# Altium schematic sheet complete.SchDoc (part 1 of 2)
size A0; PageSetup: Record=PageOptions|CenterHorizontal=True|CenterVertical=True|PrintScale=1.00|XCorrection=1.00|YCorrection=1.00|PrintKind=0|BorderSize=5000000|LeftOffset=0|BottomOffset=0|Orientation=2|PaperLength=1000|PaperWidth=1000|Scale=100|PaperSource=7|PrintQuality=-3|MediaType=1|DitherType=10|PrintScaleMode=1|PaperKind=A4|PaperIndex=9
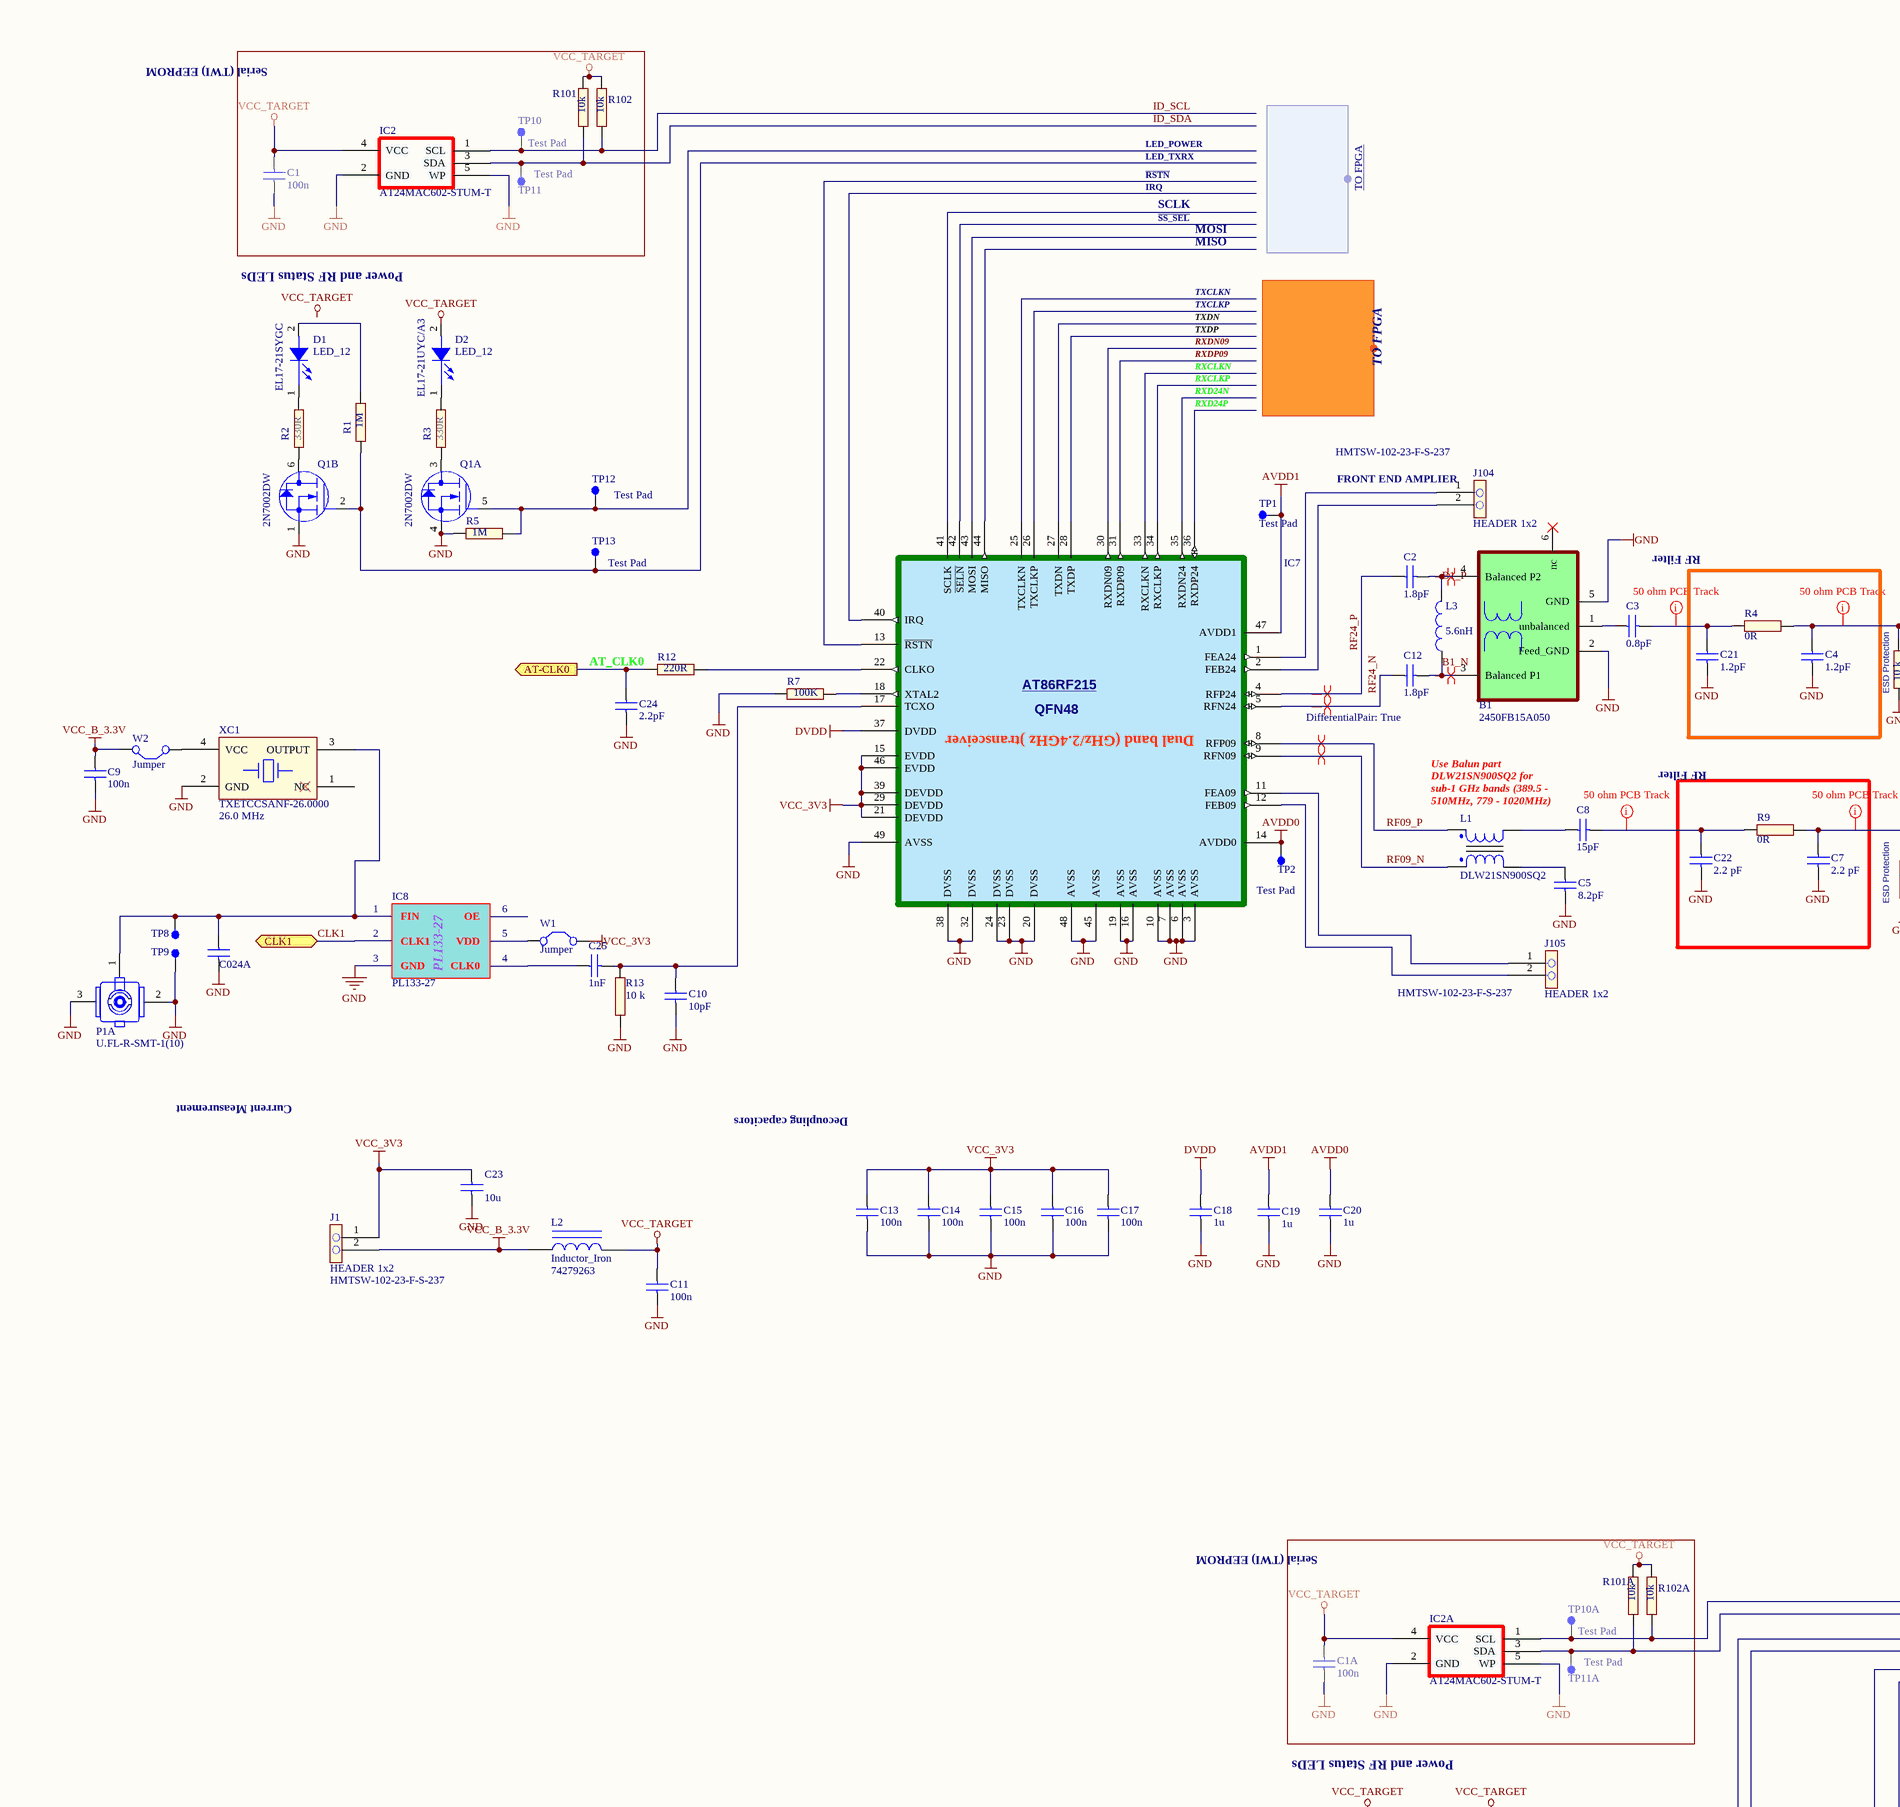
[diagram p0: complete.SchDoc, top left]
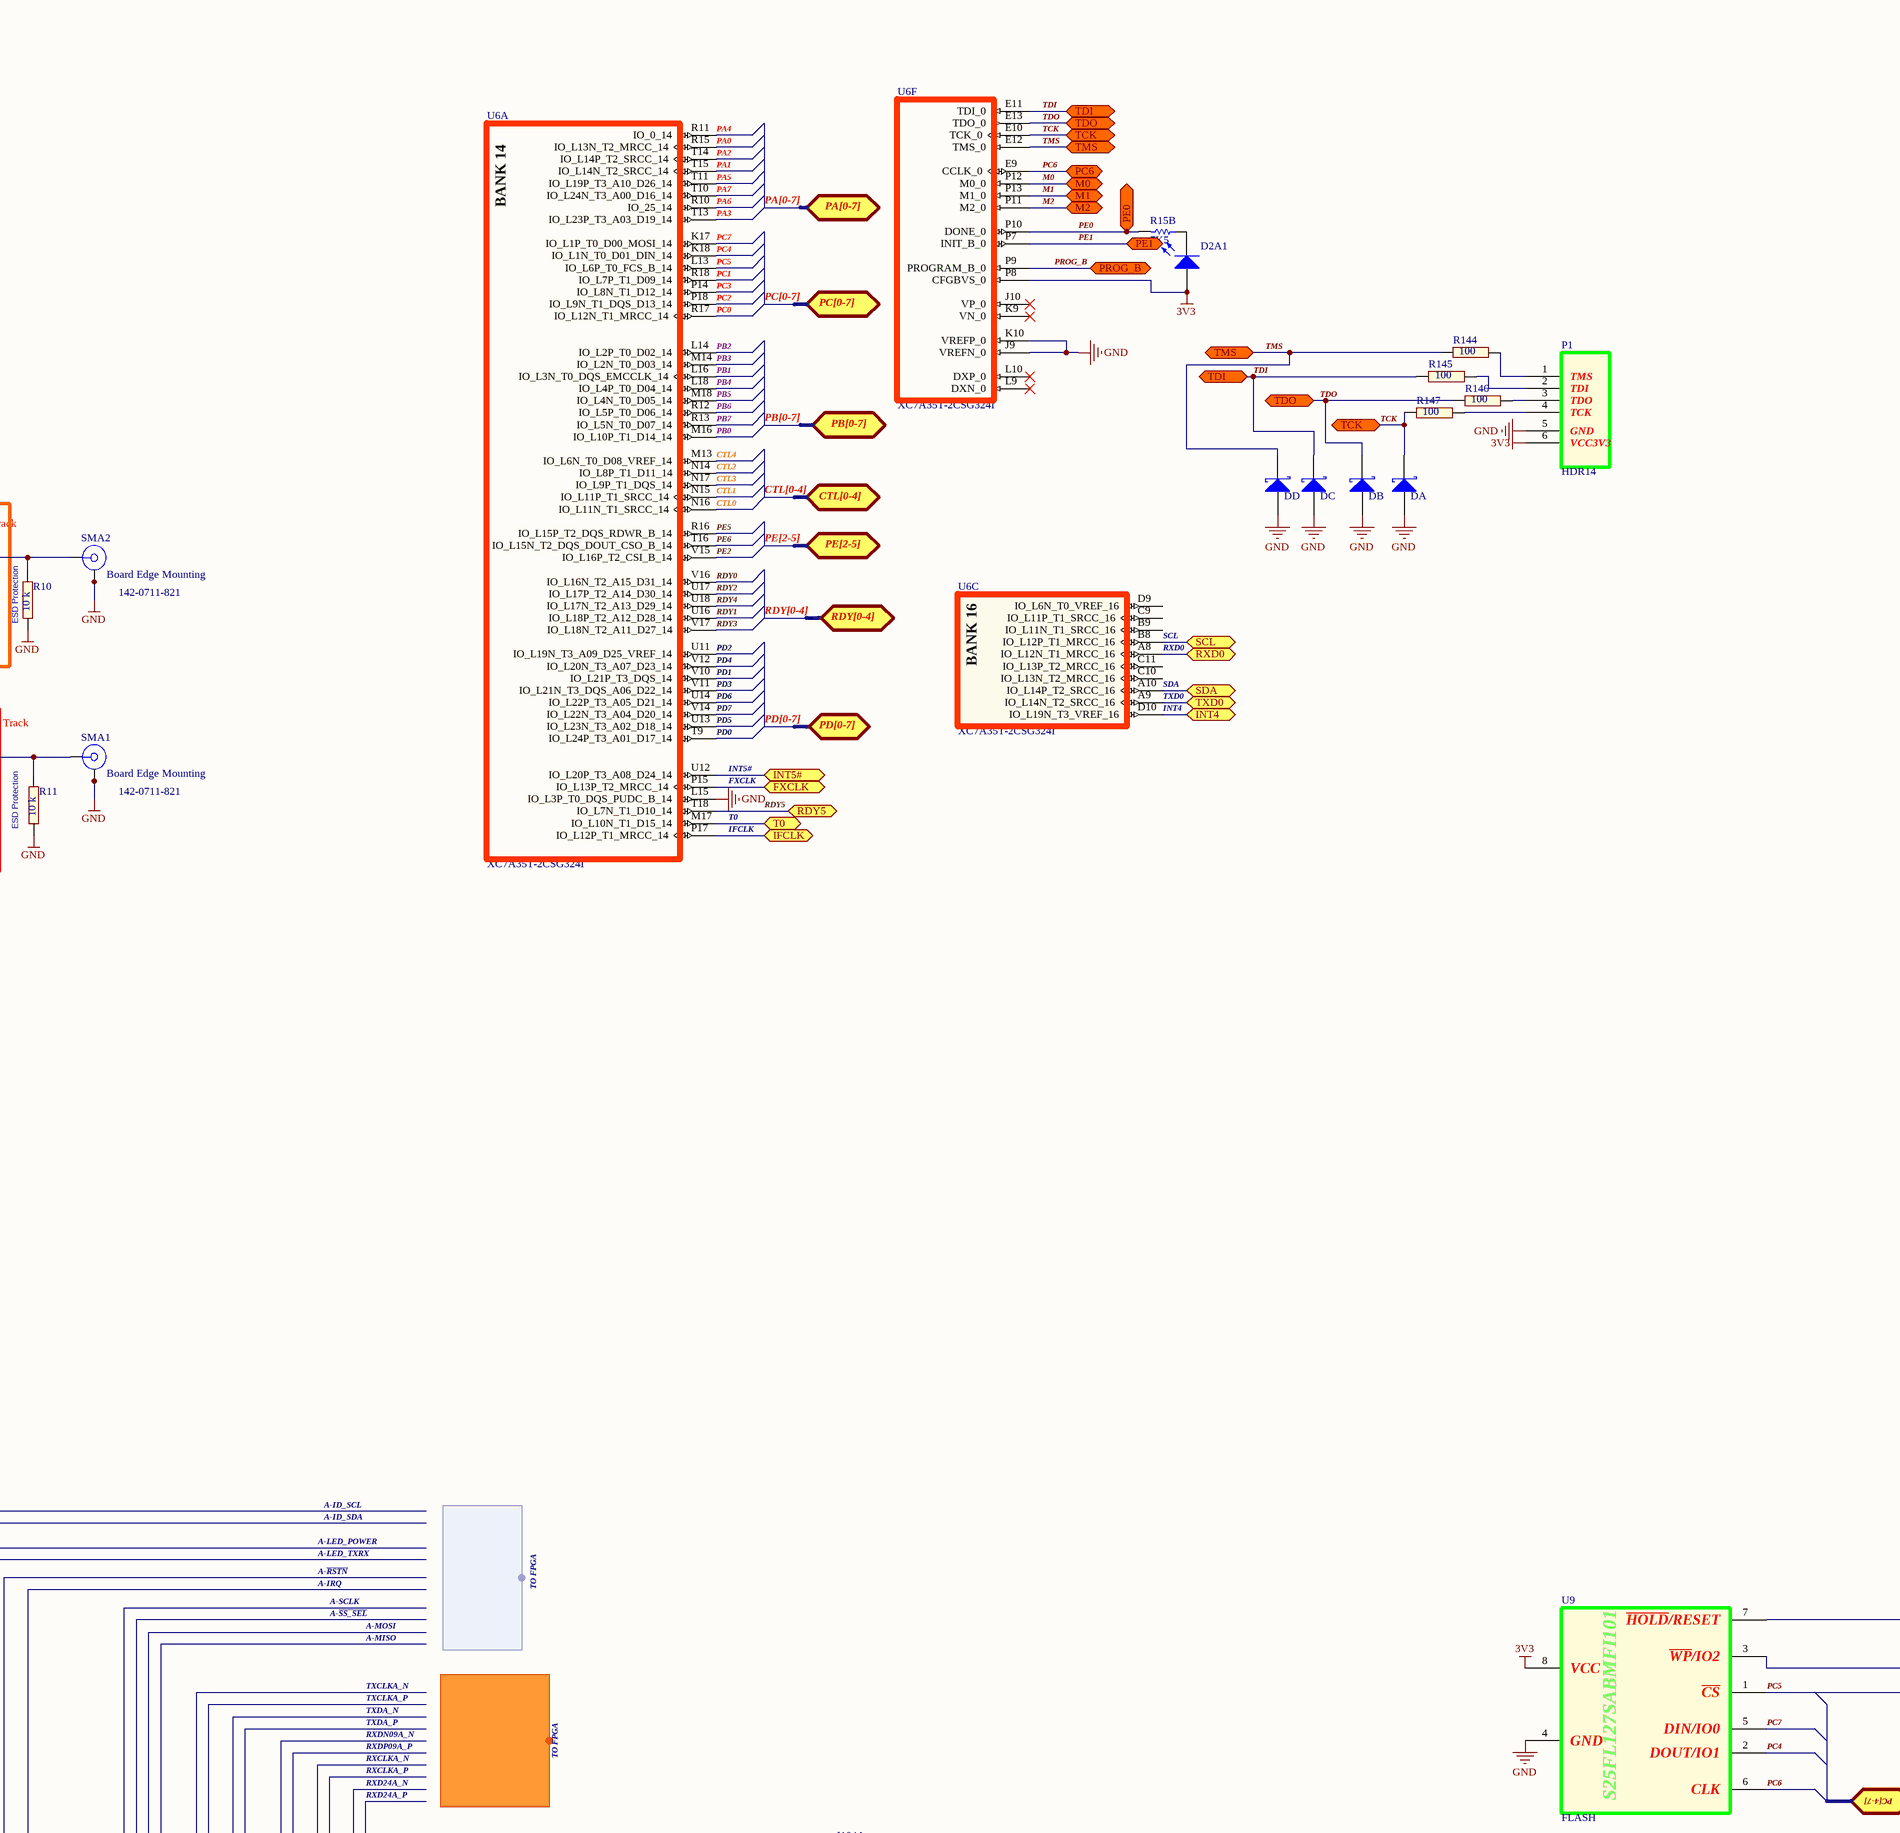
[diagram p1: complete.SchDoc, top middle]
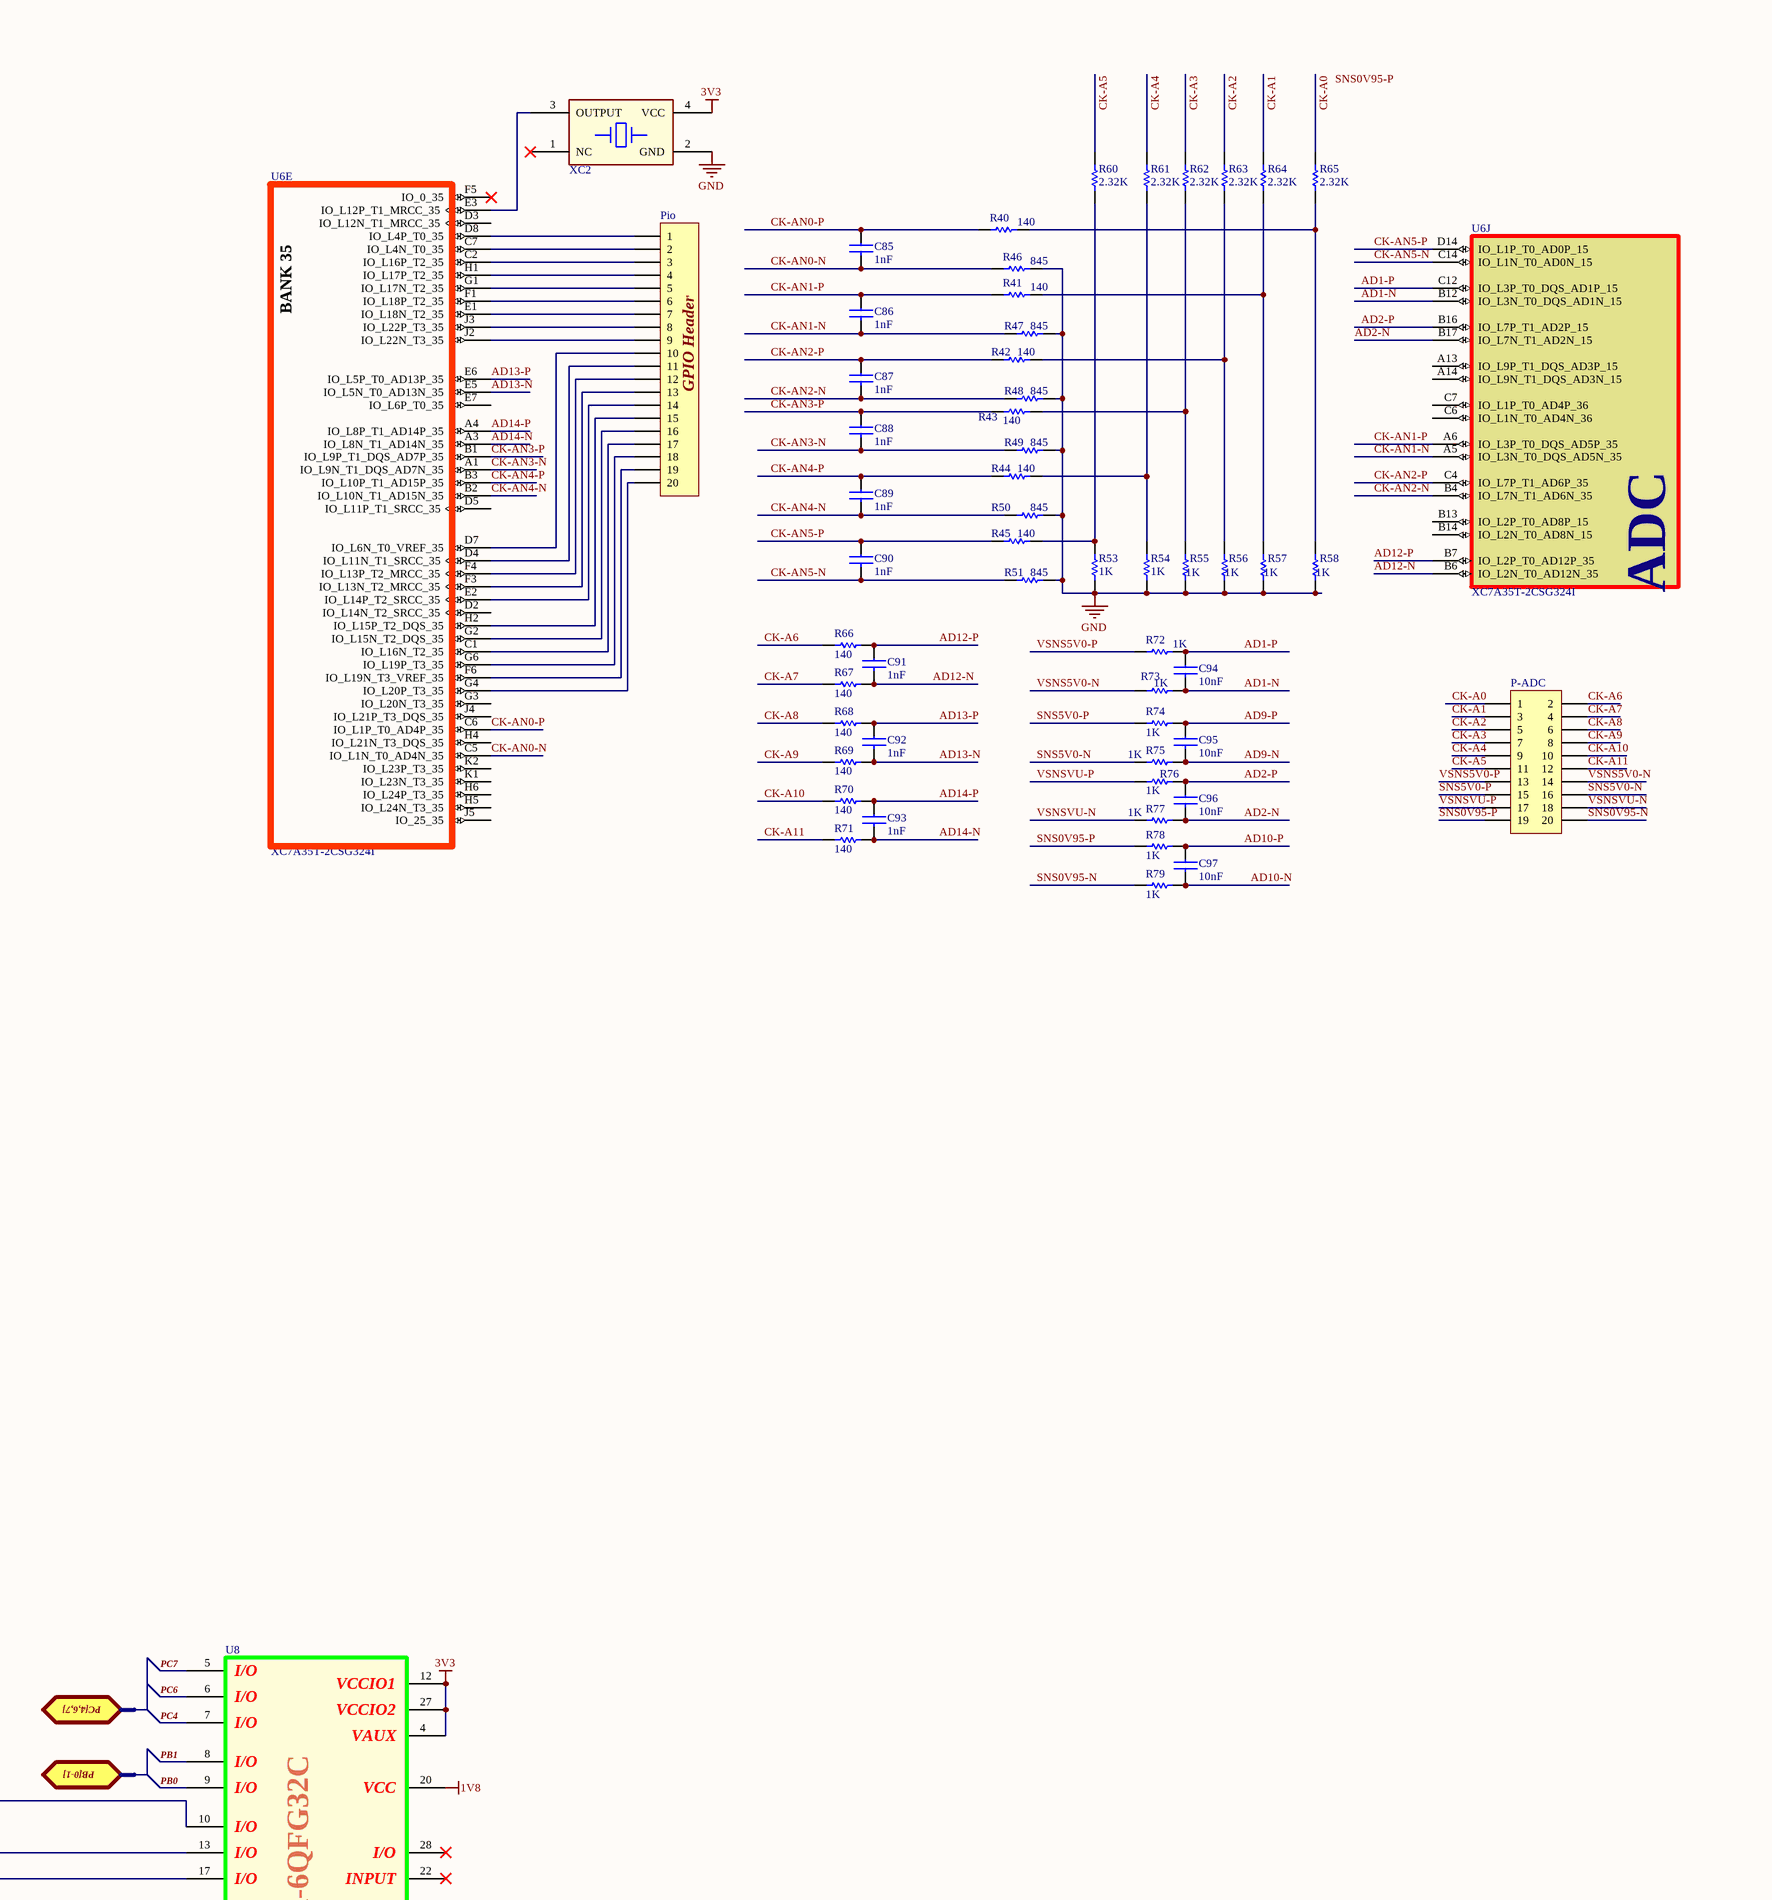
[diagram p2: complete.SchDoc, top right]
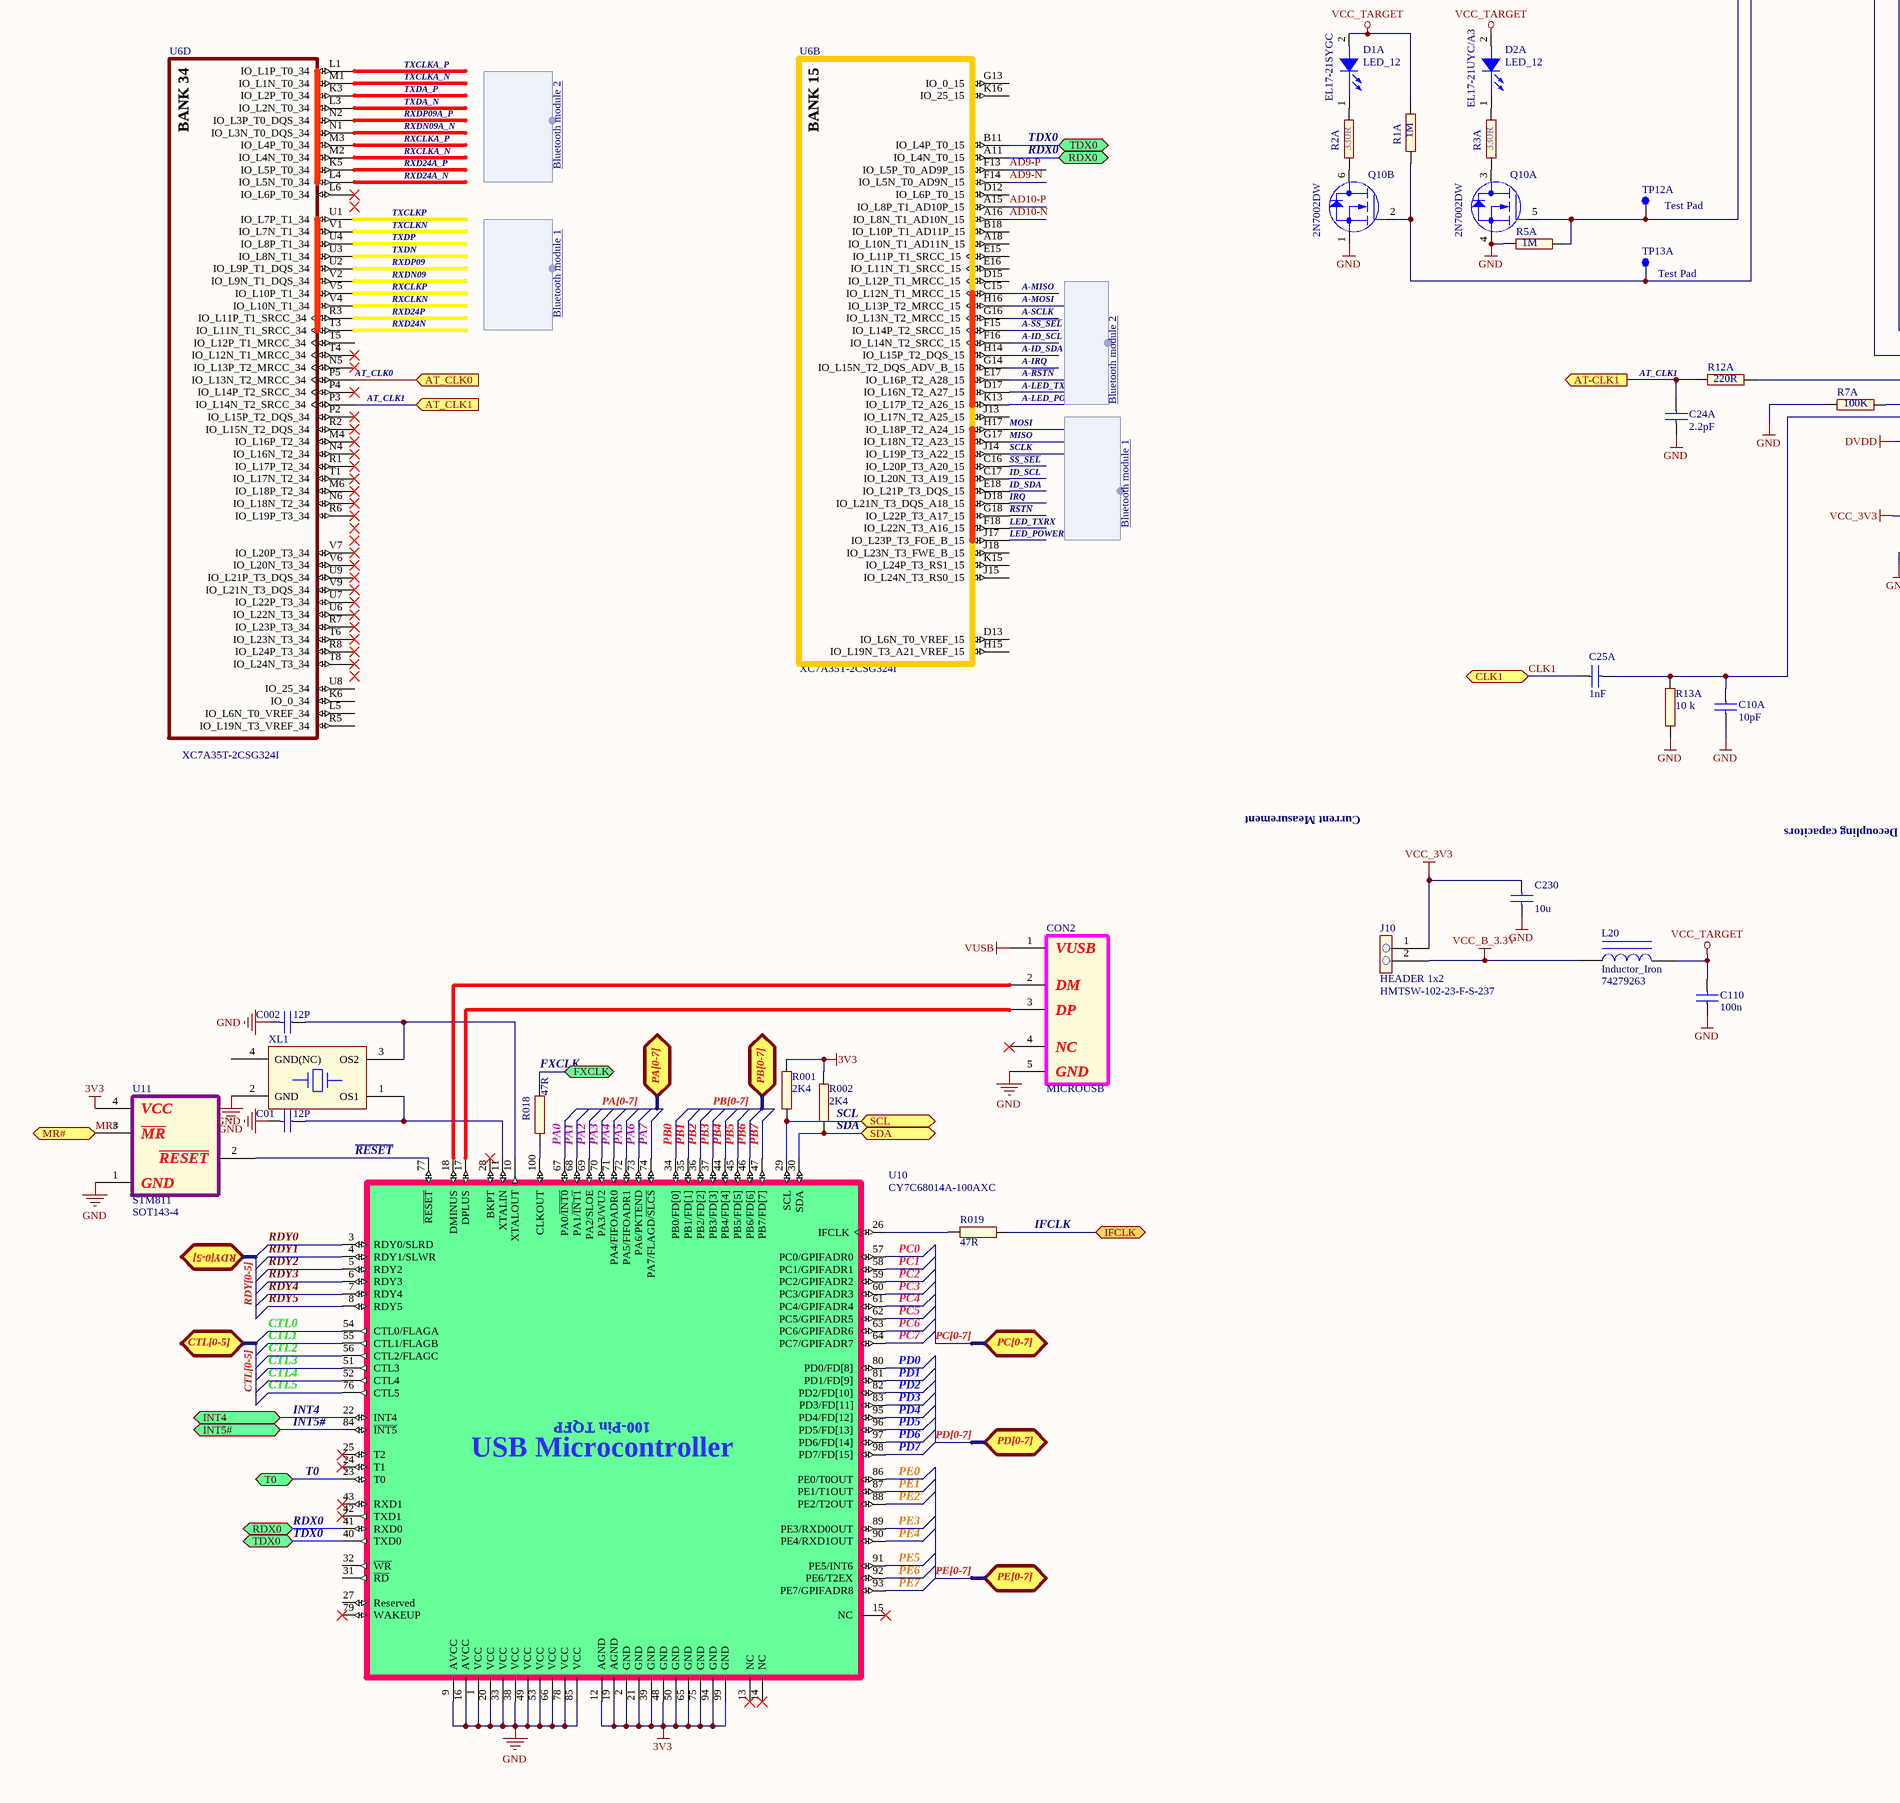
[diagram p3: complete.SchDoc, bottom left]
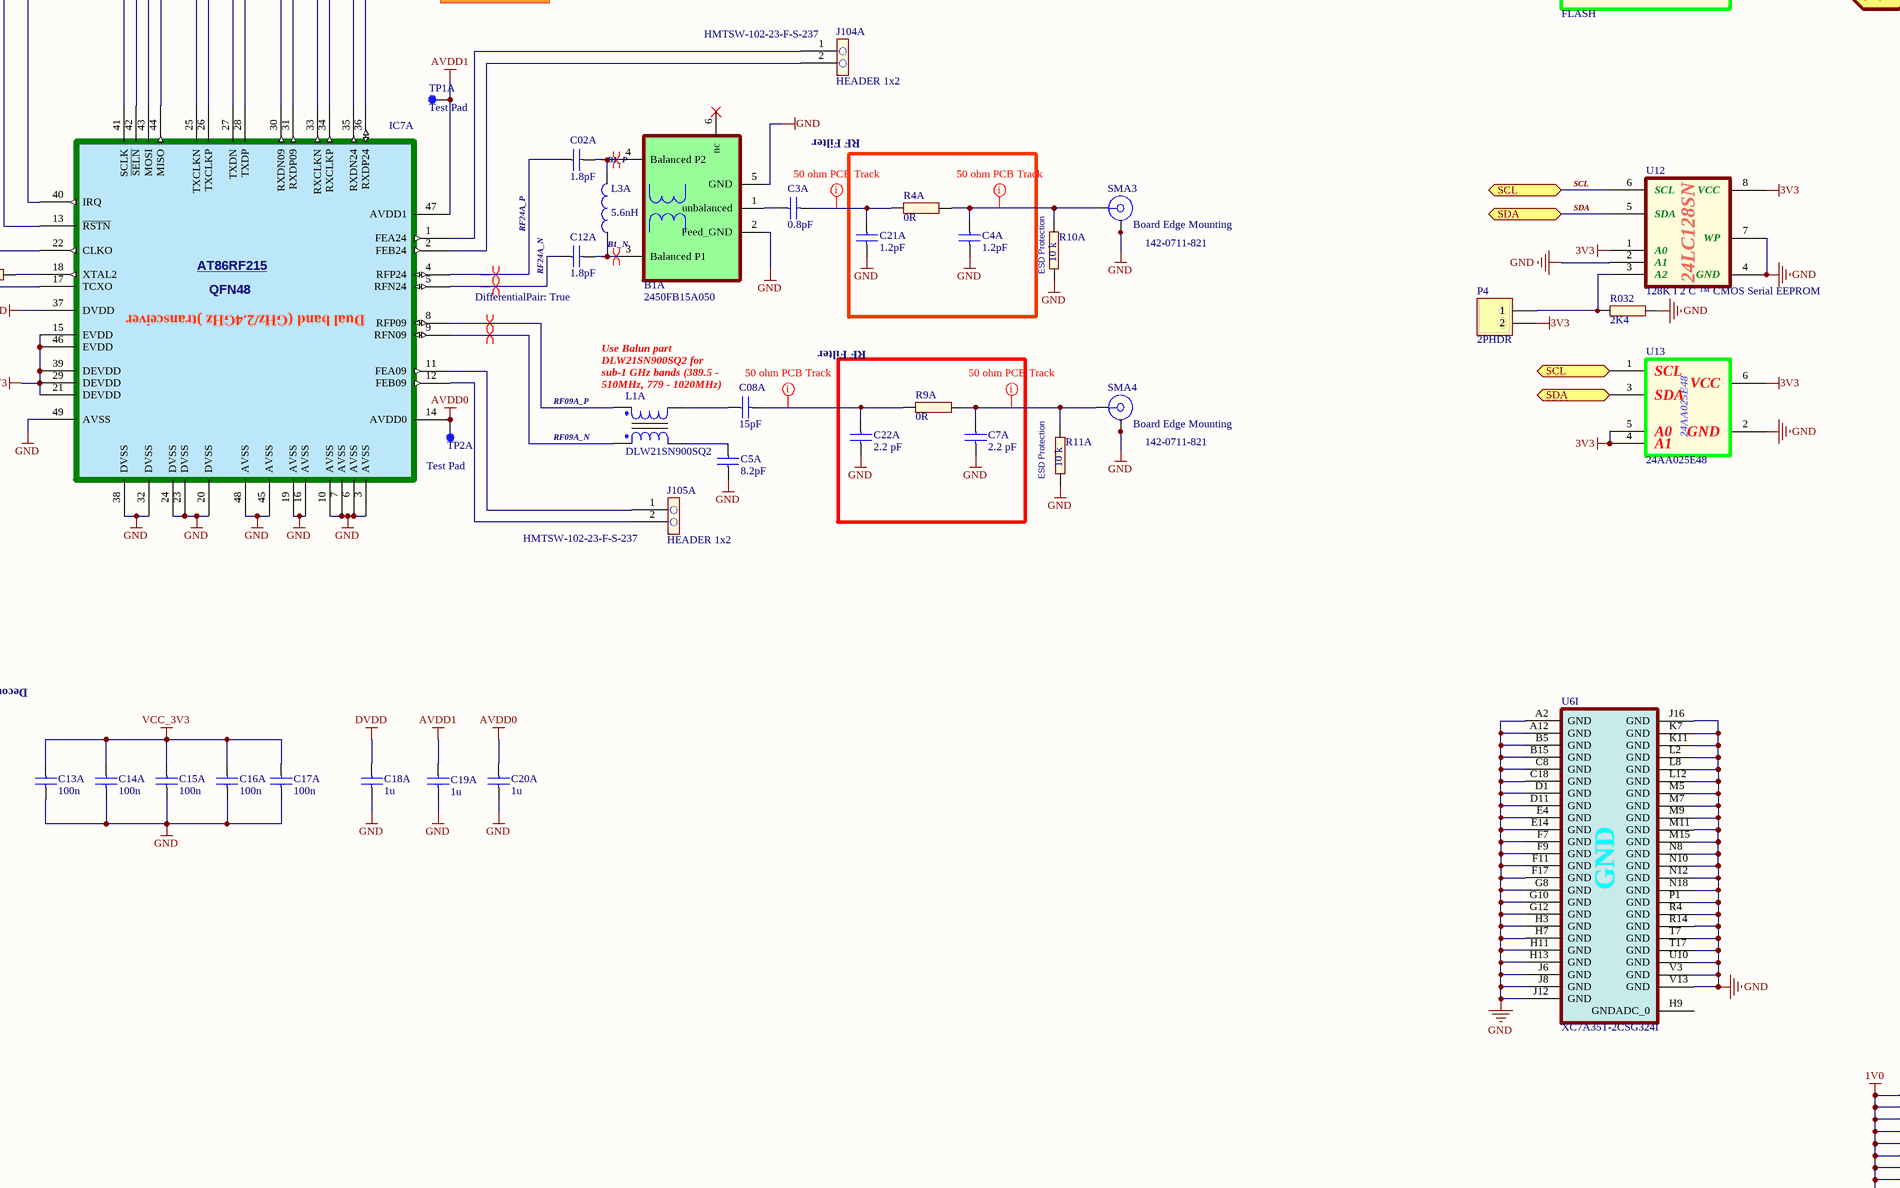
[diagram p4: complete.SchDoc, bottom middle]
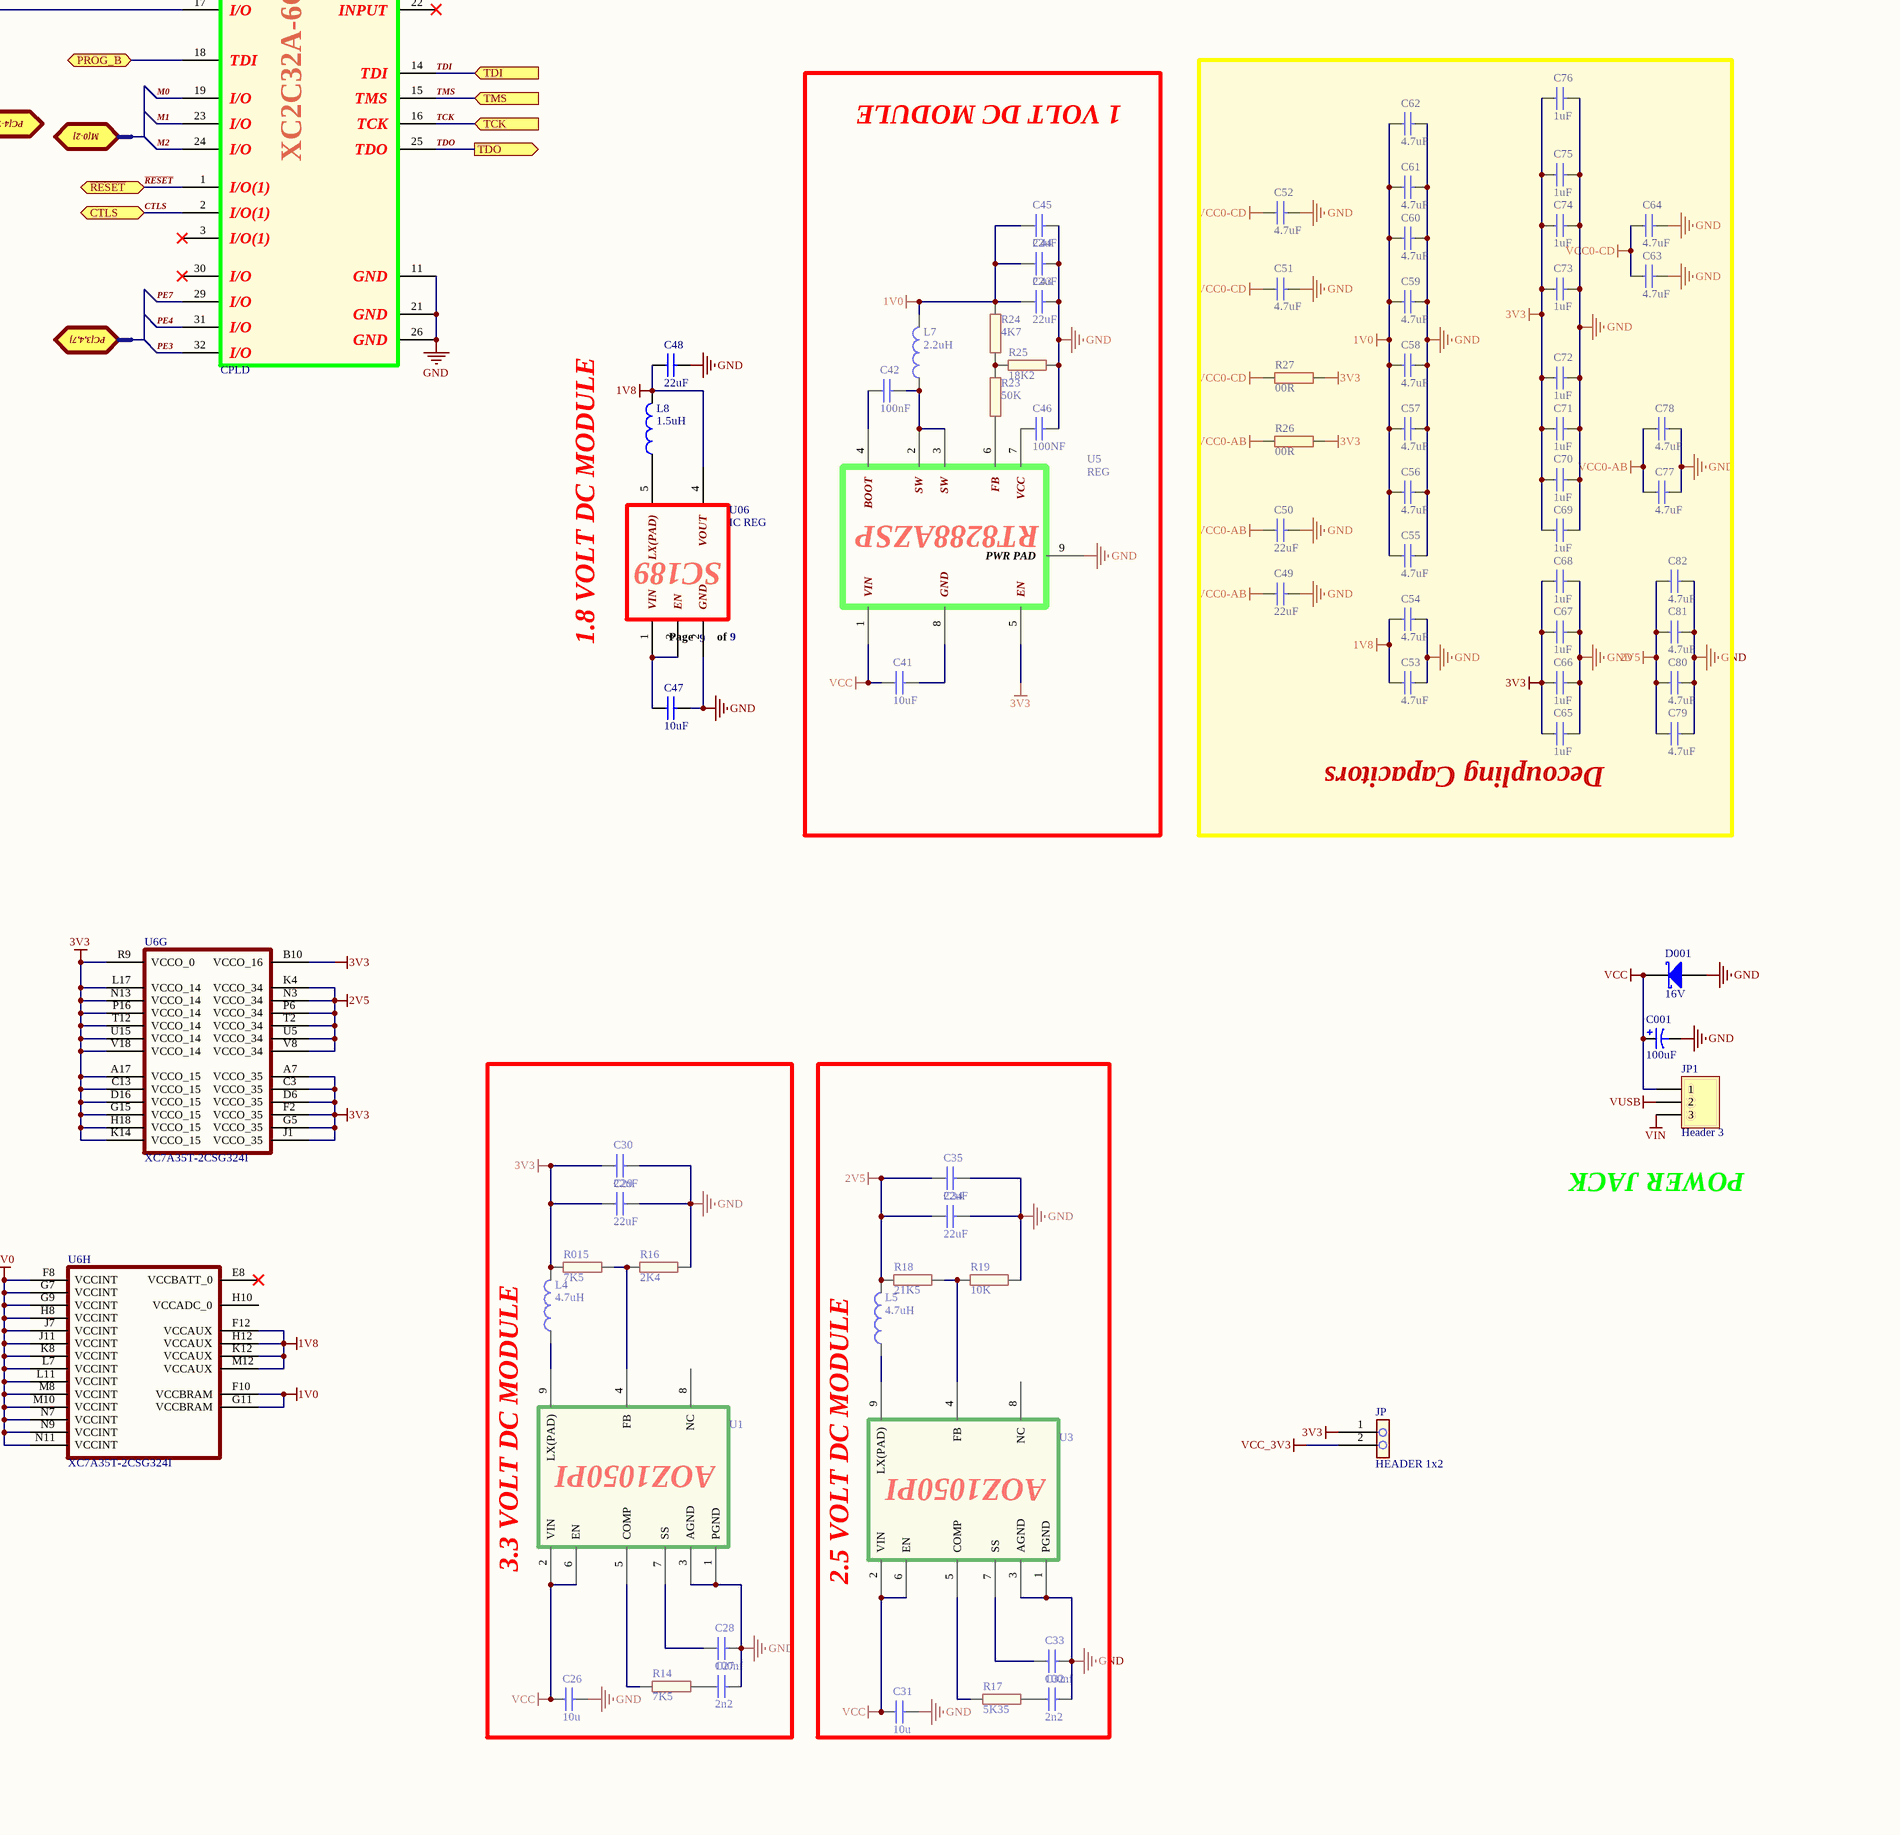
[diagram p5: complete.SchDoc, bottom right]

## Parts
B1  value 2450FB15A050  [0805 6pin Balun, narrow variant]  (hidden comment: Balun_2.4GHz)
B1A  value 2450FB15A050  [0805 6pin Balun, narrow variant]  (hidden comment: Balun_2.4GHz)
C01  value 12P  [0402]  (hidden comment: Recommended by Escatec. No datasheet available yet.)
C1  value 100n  [0402]  (hidden comment: CAP-NONPOL)
C001  value 100uF  [1206-res]  (hidden comment: Cap Pol1)
C1A  value 100n  [0402]  (hidden comment: CAP-NONPOL)
C002  value 12P  [0402]  (hidden comment: Recommended by Escatec. No datasheet available yet.)
C2  value 1.8pF  [0402]  (hidden comment: CAP-NONPOL)
C02A  value 1.8pF  [0402]  (hidden comment: CAP-NONPOL)
C3  value 0.8pF  [0201]  (hidden comment: CAP-NONPOL)
C3A  value 0.8pF  [0402]  (hidden comment: CAP-NONPOL)
C4  value 1.2pF  [0402]  (hidden comment: This 1.2pF capacitor is used for RF antennae tuning and can not be replaced by alternatives.)
C4A  value 1.2pF  [0402]  (hidden comment: This 1.2pF capacitor is used for RF antennae tuning and can not be replaced by alternatives.)
C5  value 8.2pF  [0201]  (hidden comment: CAP-NONPOL)
C5A  value 8.2pF  [0201]  (hidden comment: CAP-NONPOL)
C7  value 2.2 pF  [0402]  (hidden comment: C0G, NP0)
C7A  value 2.2 pF  [0402]  (hidden comment: C0G, NP0)
C8  value 15pF  [0201]  (hidden comment: CAP-NONPOL)
C08A  value 15pF  [0201]  (hidden comment: CAP-NONPOL)
C9  value 100n  [0402]  (hidden comment: CAP-NONPOL)
C10  value 10pF  [0402]  (hidden comment: High Temp version)
C10A  value 10pF  [0402]  (hidden comment: High Temp version)
C11  value 100n  [0402]  (hidden comment: CAP-NONPOL)
C12  value 1.8pF  [0402]  (hidden comment: CAP-NONPOL)
C12A  value 1.8pF  [0402]  (hidden comment: CAP-NONPOL)
C13  value 100n  [0402]  (hidden comment: CAP-NONPOL)
C13A  value 100n  [0402]  (hidden comment: CAP-NONPOL)
C14  value 100n  [0402]  (hidden comment: CAP-NONPOL)
C14A  value 100n  [0402]  (hidden comment: CAP-NONPOL)
C15  value 100n  [0402]  (hidden comment: CAP-NONPOL)
C15A  value 100n  [0402]  (hidden comment: CAP-NONPOL)
C16  value 100n  [0402]  (hidden comment: CAP-NONPOL)
C16A  value 100n  [0402]  (hidden comment: CAP-NONPOL)
C17  value 100n  [0402]  (hidden comment: CAP-NONPOL)
C17A  value 100n  [0402]  (hidden comment: CAP-NONPOL)
C18  value 1u  [0402]  (hidden comment: CAP-NONPOL)
C18A  value 1u  [0402]  (hidden comment: CAP-NONPOL)
C19  value 1u  [0402]  (hidden comment: CAP-NONPOL)
C19A  value 1u  [0402]  (hidden comment: CAP-NONPOL)
C20  value 1u  [0402]  (hidden comment: CAP-NONPOL)
C20A  value 1u  [0402]  (hidden comment: CAP-NONPOL)
C21  value 1.2pF  [0402]  (hidden comment: This 1.2pF capacitor is used for RF antennae tuning and can not be replaced by alternatives.)
C21A  value 1.2pF  [0402]  (hidden comment: This 1.2pF capacitor is used for RF antennae tuning and can not be replaced by alternatives.)
C22  value 2.2 pF  [0402]  (hidden comment: C0G, NP0)
C22A  value 2.2 pF  [0402]  (hidden comment: C0G, NP0)
C23  value 10u  [0603 - cap]  (hidden comment: CAP-NONPOL)
C24  value 2.2pF  [0402]  (hidden comment: CAP-NONPOL)
C24A  value 2.2pF  [0402]  (hidden comment: CAP-NONPOL)
C024A  CAP-NONPOL  [0603 - cap]  (value not drawn)
C25  value 1nF  [0201]  (hidden comment: CAP-NONPOL)
C25A  value 1nF  [0201]  (hidden comment: CAP-NONPOL)
C26  value 10u  [0603 - cap]  (hidden comment: CAP-NONPOL)
C27  value 2n2  [0603 LED]  (hidden comment: CAP-NONPOL)
C28  value 100nf  [0603 LED]  (hidden comment: CAP-NONPOL)
C29  value 22uF  [0805 - cap]  (hidden comment: CAP-NONPOL)
C30  value 22uF  [0805 - cap]  (hidden comment: CAP-NONPOL)
C31  value 10u  [0603 - cap]  (hidden comment: CAP-NONPOL)
C32  value 2n2  [0603 LED]  (hidden comment: CAP-NONPOL)
C33  value 100nf  [0603 LED]  (hidden comment: CAP-NONPOL)
C34  value 22uF  [0603 LED]  (hidden comment: CAP-NONPOL)
C35  value 22uF  [0805 - cap]  (hidden comment: CAP-NONPOL)
C41  value 10uF  [0603 - cap]  (hidden comment: CAP-NONPOL)
C42  value 100nF  [0805 - cap]  (hidden comment: CAP-NONPOL)
C43  value 22uF  [0805 - cap]  (hidden comment: CAP-NONPOL)
C44  value 22uF  [0805 - cap]  (hidden comment: CAP-NONPOL)
C45  value 22uF  [0805 - cap]  (hidden comment: CAP-NONPOL)
C46  value 100NF  [0603 - cap]  (hidden comment: CAP-NONPOL)
C47  value 10uF  [0603 - cap]  (hidden comment: CAP-NONPOL)
C48  value 22uF  [0805 - cap]  (hidden comment: CAP-NONPOL)
C49  value 22uF  [0805 - cap]  (hidden comment: Recommended by Escatec. No datasheet available yet.)
C50  value 22uF  [0805 - cap]  (hidden comment: Recommended by Escatec. No datasheet available yet.)
C51  value 4.7uF  [0402]  (hidden comment: Recommended by Escatec. No datasheet available yet.)
C52  value 4.7uF  [0402]  (hidden comment: Recommended by Escatec. No datasheet available yet.)
C53  value 4.7uF  [0402]  (hidden comment: Recommended by Escatec. No datasheet available yet.)
C54  value 4.7uF  [0402]  (hidden comment: Recommended by Escatec. No datasheet available yet.)
C55  value 4.7uF  [0402]  (hidden comment: Recommended by Escatec. No datasheet available yet.)
C56  value 4.7uF  [0402]  (hidden comment: Recommended by Escatec. No datasheet available yet.)
C57  value 4.7uF  [0402]  (hidden comment: Recommended by Escatec. No datasheet available yet.)
C58  value 4.7uF  [0402]  (hidden comment: Recommended by Escatec. No datasheet available yet.)
C59  value 4.7uF  [0402]  (hidden comment: Recommended by Escatec. No datasheet available yet.)
C60  value 4.7uF  [0402]  (hidden comment: Recommended by Escatec. No datasheet available yet.)
C61  value 4.7uF  [0402]  (hidden comment: Recommended by Escatec. No datasheet available yet.)
C62  value 4.7uF  [0402]  (hidden comment: Recommended by Escatec. No datasheet available yet.)
C63  value 4.7uF  [0402]  (hidden comment: Recommended by Escatec. No datasheet available yet.)
C64  value 4.7uF  [0402]  (hidden comment: Recommended by Escatec. No datasheet available yet.)
C65  value 1uF  [0402]  (hidden comment: Recommended by Escatec. No datasheet available yet.)
C66  value 1uF  [0402]  (hidden comment: Recommended by Escatec. No datasheet available yet.)
C67  value 1uF  [0402]  (hidden comment: Recommended by Escatec. No datasheet available yet.)
C68  value 1uF  [0402]  (hidden comment: Recommended by Escatec. No datasheet available yet.)
C69  value 1uF  [0402]  (hidden comment: Recommended by Escatec. No datasheet available yet.)
C70  value 1uF  [0402]  (hidden comment: Recommended by Escatec. No datasheet available yet.)
C71  value 1uF  [0402]  (hidden comment: Recommended by Escatec. No datasheet available yet.)
C72  value 1uF  [0402]  (hidden comment: Recommended by Escatec. No datasheet available yet.)
C73  value 1uF  [0402]  (hidden comment: Recommended by Escatec. No datasheet available yet.)
C74  value 1uF  [0402]  (hidden comment: Recommended by Escatec. No datasheet available yet.)
C75  value 1uF  [0402]  (hidden comment: Recommended by Escatec. No datasheet available yet.)
C76  value 1uF  [0402]  (hidden comment: Recommended by Escatec. No datasheet available yet.)
C77  value 4.7uF  [0402]  (hidden comment: Recommended by Escatec. No datasheet available yet.)
C78  value 4.7uF  [0402]  (hidden comment: Recommended by Escatec. No datasheet available yet.)
C79  value 4.7uF  [0603 - cap]  (hidden comment: Recommended by Escatec. No datasheet available yet.)
C80  value 4.7uF  [0603 - cap]  (hidden comment: Recommended by Escatec. No datasheet available yet.)
C81  value 4.7uF  [0603 - cap]  (hidden comment: Recommended by Escatec. No datasheet available yet.)
C82  value 4.7uF  [0603 - cap]  (hidden comment: Recommended by Escatec. No datasheet available yet.)
C85  value 1nF  [0402-res]  (hidden comment: CAP-NONPOL)
C86  value 1nF  [0402-res]  (hidden comment: CAP-NONPOL)
C87  value 1nF  [0402-res]  (hidden comment: CAP-NONPOL)
C88  value 1nF  [0402-res]  (hidden comment: CAP-NONPOL)
C89  value 1nF  [0402-res]  (hidden comment: CAP-NONPOL)
C90  value 1nF  [0402-res]  (hidden comment: CAP-NONPOL)
C91  value 1nF  [0402-res]
C92  value 1nF  [0402-res]
C93  value 1nF  [0402-res]
C94  value 10nF  [0402-res]
C95  value 10nF  [0402-res]
C96  value 10nF  [0402-res]
C97  value 10nF  [0402-res]
C110  value 100n  [0402]  (hidden comment: CAP-NONPOL)
C230  value 10u  [0603 - cap]  (hidden comment: CAP-NONPOL)
CON2  MICROUSB  [MICRO-USB-B-Receptable]
D1  LED_12  value EL17-21SYGC  [0805 diode]
D001  D Schottky  [0805 diode]  (value not drawn)
D1A  LED_12  value EL17-21SYGC  [0805 diode]
D2  LED_12  value EL17-21UYC/A3  [0805 diode]
D2A  LED_12  value EL17-21UYC/A3  [0805 diode]
D2A1  LED0  [0805 diode]  (value not drawn)
DA  D Schottky  [0603 LED]  (value not drawn)
DB  D Schottky  [0603 LED]  (value not drawn)
DC  D Schottky  [0603 LED]  (value not drawn)
DD  D Schottky  [0603 LED]  (value not drawn)
IC2  value AT24MAC602-STUM-T  [SOT23-5]  (hidden comment: AT24MAC602)
IC2A  value AT24MAC602-STUM-T  [SOT23-5]  (hidden comment: AT24MAC602)
IC7  48 lead QFN package  [48 pin QFN, 7x7 mm]  (value not drawn)
IC7A  48 lead QFN package  [48 pin QFN, 7x7 mm]  (value not drawn)
IC8  PL133-27  [uDFN-6]
J1  HEADER 1x2  value HMTSW-102-23-F-S-237  [HDR1X2]
J10  HEADER 1x2  value HMTSW-102-23-F-S-237  [HDR1X2]
J104  HEADER 1x2  value HMTSW-102-23-F-S-237  [HDR1X2]
J104A  HEADER 1x2  value HMTSW-102-23-F-S-237  [HDR1X2]
J105  HEADER 1x2  value HMTSW-102-23-F-S-237  [HDR1X2]
J105A  HEADER 1x2  value HMTSW-102-23-F-S-237  [HDR1X2]
JP  HEADER 1x2  [HDR1X2]
JP1  Header 3  [HDR1X3]
L1  value DLW21SN900SQ2  [DR127 Series Inductor]  (hidden comment: Common Mode Choke 0805)
L1A  value DLW21SN900SQ2  [DR127 Series Inductor]  (hidden comment: Common Mode Choke 0805)
L2  Inductor_Iron  value 74279263  [0402]
L3  value 5.6nH  [0402]  (hidden comment: ceramic chip inductor, 5.6nH, 0201)
L3A  value 5.6nH  [0402]  (hidden comment: ceramic chip inductor, 5.6nH, 0201)
L4  value 4.7uH  [1210-RES]
L5  value 4.7uH  [1210-RES]
L7  value 2.2uH  [0805 - cap]
L8  value 1.5uH  [0805 - cap]
L20  Inductor_Iron  value 74279263  [0402]
P1  HDR14
P1A  value U.FL-R-SMT-1(10)  [AP8-00380]  (hidden comment: Copy of A08-0629)
P4  2PHDR  [Pin header 1x2 Pin in Paste]
P-ADC  Header 10X2H  [2x5 Receptacle THM]  (value not drawn)
Pio  GPIO Header  [2x5 Receptacle THM]
Q1  value 2N7002DW  [SOT23-6 - duplicate]  (hidden comment: Same as 2N7002 but with two MOSFETs in one package)  (parts A,B of 2)
Q10  value 2N7002DW  [SOT23-6 - duplicate]  (hidden comment: Same as 2N7002 but with two MOSFETs in one package)  (parts A,B of 2)
R001  value 2K4  [0201]  (hidden comment: R2)
R1  value 1M  [0201]  (hidden comment: R2)
R1A  value 1M  [0201]  (hidden comment: R2)
R002  value 2K4  [0201]  (hidden comment: R2)
R2  value 330R  [0201]  (hidden comment: R2)
R2A  value 330R  [0201]  (hidden comment: R2)
R3  value 330R  [0201]  (hidden comment: R2)
R3A  value 330R  [0201]  (hidden comment: R2)
R4  value 0R  [0201]  (hidden comment: Copy of A02-0534)
R4A  value 0R  [0201]  (hidden comment: Copy of A02-0534)
R5  value 1M  [0201]  (hidden comment: R2)
R5A  value 1M  [0201]  (hidden comment: R2)
R7  value 100K  [0201]  (hidden comment: R2)
R7A  value 100K  [0201]  (hidden comment: R2)
R9  value 0R  [0201]  (hidden comment: Copy of A02-0534)
R9A  value 0R  [0201]  (hidden comment: Copy of A02-0534)
R10  value 10 k  [0201]  (hidden comment: Copy of A02-0535)
R10A  value 10 k  [0201]  (hidden comment: Copy of A02-0535)
R11  value 10 k  [0201]  (hidden comment: Copy of A02-0535)
R11A  value 10 k  [0201]  (hidden comment: Copy of A02-0535)
R12  value 220R  [0201]  (hidden comment: R2)
R12A  value 220R  [0201]  (hidden comment: R2)
R13  value 10 k  [0201]  (hidden comment: Copy of A02-0535)
R13A  value 10 k  [0201]  (hidden comment: Copy of A02-0535)
R14  value 7K5  [0201]
R015  value 7K5  [0201]
R15B  value 7K5  [0201]  (hidden comment: Res1)
R16  value 2K4  [0201]
R17  value 5K35  [0201]
R018  value 47R  [0201]  (hidden comment: R2)
R18  value 21K5  [0201]
R019  value 47R  [0201]  (hidden comment: R2)
R19  value 10K  [0201]
R23  value 50K  [0201]
R24  value 4K7  [0201]
R25  value 18K2  [0201]
R26  value 00R  [0201]
R27  value 00R  [0201]
R032  value 2K4  [0201]  (hidden comment: R2)
R40  value 140  [0402]  (hidden comment: Res1)
R41  value 140  [0402]  (hidden comment: Res1)
R42  value 140  [0402]  (hidden comment: Res1)
R43  value 140  [0402]  (hidden comment: Res1)
R44  value 140  [0402]  (hidden comment: Res1)
R45  value 140  [0402]  (hidden comment: Res1)
R46  value 845  [0402]  (hidden comment: Res1)
R47  value 845  [0402]  (hidden comment: Res1)
R48  value 845  [0402]  (hidden comment: Res1)
R49  value 845  [0402]  (hidden comment: Res1)
R50  value 845  [0402]  (hidden comment: Res1)
R51  value 845  [0402]  (hidden comment: Res1)
R53  value 1K  [0402]  (hidden comment: Res1)
R54  value 1K  [0402]  (hidden comment: Res1)
R55  value 1K  [0402]  (hidden comment: Res1)
R56  value 1K  [0402]  (hidden comment: Res1)
R57  value 1K  [0402]  (hidden comment: Res1)
R58  value 1K  [0402]  (hidden comment: Res1)
R60  value 2.32K  [0402]  (hidden comment: Res1)
R61  value 2.32K  [0402]  (hidden comment: Res1)
R62  value 2.32K  [0402]  (hidden comment: Res1)
R63  value 2.32K  [0402]  (hidden comment: Res1)
R64  value 2.32K  [0402]  (hidden comment: Res1)
R65  value 2.32K  [0402]  (hidden comment: Res1)
R66  value 140  [0402]
R67  value 140  [0402]
R68  value 140  [0402]
R69  value 140  [0402]
R70  value 140  [0402]
R71  value 140  [0402]
R72  value 1K  [0402]  (hidden comment: Res1)
R73  value 1K  [0402]  (hidden comment: Res1)
R74  value 1K  [0402]  (hidden comment: Res1)
R75  value 1K  [0402]  (hidden comment: Res1)
R76  value 1K  [0402]  (hidden comment: Res1)
R77  value 1K  [0402]  (hidden comment: Res1)
R78  value 1K  [0402]  (hidden comment: Res1)
R79  value 1K  [0402]  (hidden comment: Res1)
R101  value 10k  [0201]  (hidden comment: R2)
R101A  value 10k  [0201]  (hidden comment: R2)
R102  value 10k  [0201]  (hidden comment: R2)
R102A  value 10k  [0201]  (hidden comment: R2)
R144  value 100  [0402]
R145  value 100  [0402]
R146  value 100  [0402]
R147  value 100  [0402]
SMA1  Board Edge Mounting  value 142-0711-821  [SMA]
SMA2  Board Edge Mounting  value 142-0711-821  [SMA]
SMA3  Board Edge Mounting  value 142-0711-821  [SMA]
SMA4  Board Edge Mounting  value 142-0711-821  [SMA]
TP1  value Test Pad  [Testpad 29 mil]  (hidden comment: TESTPOINT)  (no BOM)
TP1A  value Test Pad  [Testpad 29 mil]  (hidden comment: TESTPOINT)  (no BOM)
TP2  value Test Pad  [Testpad 29 mil]  (hidden comment: TESTPOINT)  (no BOM)
TP2A  value Test Pad  [Testpad 29 mil]  (hidden comment: TESTPOINT)  (no BOM)
TP8  Mounting hole dia should be 1.6mm. Refer A08-2059  [Testpad 29 mil]  (value not drawn)  (no BOM)
TP9  Mounting hole dia should be 1.6mm. Refer A08-2059  [Testpad 29 mil]  (value not drawn)  (no BOM)
TP10  value Test Pad  [Testpad 29 mil]  (hidden comment: TESTPOINT)  (no BOM)
TP10A  value Test Pad  [Testpad 29 mil]  (hidden comment: TESTPOINT)  (no BOM)
TP11  value Test Pad  [Testpad 29 mil]  (hidden comment: TESTPOINT)  (no BOM)
TP11A  value Test Pad  [Testpad 29 mil]  (hidden comment: TESTPOINT)  (no BOM)
TP12  value Test Pad  [Testpad 29 mil]  (hidden comment: TESTPOINT)  (no BOM)
TP12A  value Test Pad  [Testpad 29 mil]  (hidden comment: TESTPOINT)  (no BOM)
TP13  value Test Pad  [Testpad 29 mil]  (hidden comment: TESTPOINT)  (no BOM)
TP13A  value Test Pad  [Testpad 29 mil]  (hidden comment: TESTPOINT)  (no BOM)
U1  AOZ1050PI  [so8exposed pad]  (value not drawn)
U3  AOZ1050PI  [so8exposed pad]  (value not drawn)
U5  REG  [so8exposed pad]
U6  XC7A35T-2CSG324I  [CSG324]  (parts A,B,C,D,E,F,G,H,I,J of 10)
U06  IC REG  [SOT23-5]
U8  CPLD  [QFN32_5X5MM_EP3P3MM]
U9  FLASH  [SO8]
U10  CY7C68014A-100AXC  [100qfp]
U11  STM811  [SOT143]
U12  128K I 2 C ™ CMOS Serial EEPROM  [SO8]
U13  24AA025E48  [sot23-6]
W1  Jumper  [0201]
W2  Jumper  [0201]
XC1  TXETCCSANF-26.0000  value 26.0 MHz  [CRYS]
XC2  TXETCCSANF-26.0000  [CRYS]  (value not drawn)
XL1  (no value)  [CRYS]

## Blocks framed on the sheet
Serial (TWI) EEPROM: C1 IC2 R101 R102 TP10 TP11
RF Filter: C7 C22 R9
Serial (TWI) EEPROM: C1A IC2A R101A R102A TP10A TP11A
Decoupling Capacitors: C49-C82 R26 R27
1 VOLT DC MODULE: C41-C46 L7 R23-R25 U5
RF Filter: C7A C22A R9A
3.3 VOLT DC MODULE: C26-C30 L4 R14 R015 R16 U1
2.5 VOLT DC MODULE: C31-C35 L5 R17-R19 U3

## Ports
 (bidir), AT-CLK0 (out), AT-CLK1 (out), AT_CLK0 (in), AT_CLK1 (in), CLK1, CTLS (bidir), FXCLK, IFCLK, INT4, INT5#, M0, M1, M2, MR# (bidir), PC6, PE0, PE1, PROG_B, PROG_B (bidir), RDX0, RDY5, RXD0, SCL, SCL (in), SDA, T0, TCK, TCK (in), TDI, TDI (in), TDO, TDO (out), TDX0, TMS, TMS (in), TXD0, ~{RESET} (bidir), 

## Harnesses
Bluetooth module 1: 
Bluetooth module 2: 
TO FPGA: 

## Nets
1V0: C43.1 C44.1 C45.1 C55.1 C56.1 C57.1 C58.1 C59.1 C60.1 C61.1 C62.1 L7.2 R24.1 U6.F8(VCCINT) U6.F10(VCCBRAM) U6.G7(VCCINT) U6.G9(VCCINT) U6.G11(VCCBRAM) U6.H8(VCCINT) U6.J7(VCCINT) U6.J11(VCCINT) U6.K8(VCCINT) U6.L7(VCCINT) U6.L11(VCCINT) U6.M8(VCCINT) U6.M10(VCCINT) U6.N7(VCCINT) U6.N9(VCCINT) U6.N11(VCCINT)
1V8: C48.1 C53.1 C54.1 L8.2 U06.4(VOUT) U6.F12(VCCAUX) U6.H12(VCCAUX) U6.K12(VCCAUX) U6.M12(VCCAUX) U8.20(VCC)
2V5: C34.1 C35.1 C79.1 C80.1 C81.1 C82.1 L5.2 R18.2 U6.K4(VCCO_34) U6.N3(VCCO_34) U6.P6(VCCO_34) U6.T2(VCCO_34) U6.U5(VCCO_34) U6.V8(VCCO_34)
3V3: C29.1 C30.1 C65.1 C66.1 C67.1 C68.1 C69.1 C70.1 C71.1 C72.1 C73.1 C74.1 C75.1 C76.1 D2A1.1(A) JP.1 L4.2 P1.6(VCC3V3) P4.2 R001.2 R002.2 R015.2 R26.1 R27.1 U5.5(EN) U6.A7(VCCO_35) U6.A17(VCCO_15) U6.B10(VCCO_16) U6.C3(VCCO_35) U6.C13(VCCO_15) U6.D6(VCCO_35) U6.D16(VCCO_15) U6.F2(VCCO_35) U6.G5(VCCO_35) U6.G15(VCCO_15) U6.H18(VCCO_15) U6.J1(VCCO_35) U6.K14(VCCO_15) U6.L17(VCCO_14) U6.N13(VCCO_14) U6.P8(CFGBVS_0) U6.P16(VCCO_14) U6.R9(VCCO_0) U6.T12(VCCO_14) U6.U15(VCCO_14) U6.V18(VCCO_14) U8.4(VAUX) U8.12(VCCIO1) U8.27(VCCIO2) U9.8(VCC) U10.2(GND) U10.12(AGND) U10.19(AGND) U10.21(GND) U10.39(GND) U10.48(GND) U10.50(GND) U10.65(GND) U10.75(GND) U10.94(GND) U10.99(GND) U11.4(VCC) U12.1(A0) U12.8(VCC) U13.4(A1) U13.5(A0) U13.6(VCC) XC2.4(VCC)
AVDD0: C20.1 C20A.1 IC7.14(AVDD0) IC7A.14(AVDD0) TP2.1 TP2A.1
AVDD1: C19.1 C19A.1 IC7.47(AVDD1) IC7A.47(AVDD1) TP1.1 TP1A.1
DVDD: C18.1 C18A.1 IC7.37(DVDD) IC7A.37(DVDD)
GND: B1.2(Feed_GND) B1.5(GND) B1A.2(Feed_GND) B1A.5(GND) C1.1 C01.2 C001.2 C1A.1 C002.2 C4.2 C4A.2 C5.2 C5A.2 C7.2 C7A.2 C9.2 C10.2 C10A.2 C11.1 C13.2 C13A.2 C14.2 C14A.2 C15.2 C15A.2 C16.2 C16A.2 C17.2 C17A.2 C18.2 C18A.2 C19.2 C19A.2 C20.2 C20A.2 C21.2 C21A.2 C22.2 C22A.2 C23.2 C24.2 C24A.2 C024A.2 C26.2 C27.2 C28.2 C29.2 C30.2 C31.2 C32.2 C33.2 C34.2 C35.2 C43.2 C44.2 C45.2 C46.2 C47.2 C48.2 C49.2 C50.2 C51.2 C52.2 C53.2 C54.2 C55.2 C56.2 C57.2 C58.2 C59.2 C60.2 C61.2 C62.2 C63.2 C64.2 C65.2 C66.2 C67.2 C68.2 C69.2 C70.2 C71.2 C72.2 C73.2 C74.2 C75.2 C76.2 C77.2 C78.2 C79.2 C80.2 C81.2 C82.2 C110.1 C230.2 CON2.5(GND) D001.1(A) DA.1(A) DB.1(A) DC.1(A) DD.1(A) IC2.2(GND) IC2.5(WP) IC2A.2(GND) IC2A.5(WP) IC7.3(AVSS) IC7.6(AVSS) IC7.7(AVSS) IC7.10(AVSS) IC7.16(AVSS) IC7.19(AVSS) IC7.20(DVSS) IC7.23(DVSS) IC7.24(DVSS) IC7.32(DVSS) IC7.38(DVSS) IC7.45(AVSS) IC7.48(AVSS) IC7.49(AVSS) IC7A.3(AVSS) IC7A.6(AVSS) IC7A.7(AVSS) IC7A.10(AVSS) IC7A.16(AVSS) IC7A.19(AVSS) IC7A.20(DVSS) IC7A.23(DVSS) IC7A.24(DVSS) IC7A.32(DVSS) IC7A.38(DVSS) IC7A.45(AVSS) IC7A.48(AVSS) IC7A.49(AVSS) IC8.3(GND) P1.5(GND) P1A.2(GND) P1A.3(GND) Q1.1(S2) Q1.4(S1) Q10.1(S2) Q10.4(S1) R5.2 R5A.2 R7.2 R7A.2 R10.1 R10A.1 R11.1 R11A.1 R13.1 R13A.1 R16.1 R19.1 R25.2 R032.2 R46.2 R47.2 R48.2 R49.2 R50.2 R51.2 R53.1 R54.1 R55.1 R56.1 R57.1 R58.1 SMA1.2 SMA1.2.1 SMA2.2 SMA2.2.1 SMA3.2 SMA3.2.1 SMA4.2 SMA4.2.1 TP9.1 U1.1(PGND) U1.3(AGND) U3.1(PGND) U3.3(AGND) U5.9(PWR_PAD) U06.2(GND) U6.A2(GND) U6.A12(GND) U6.B5(GND) U6.B15(GND) U6.C8(GND) U6.C18(GND) U6.D1(GND) U6.D11(GND) U6.E4(GND) U6.E14(GND) U6.F7(GND) U6.F9(GND) U6.F11(GND) U6.F17(GND) U6.G8(GND) U6.G10(GND) U6.G12(GND) U6.H3(GND) U6.H7(GND) U6.H11(GND) U6.H13(GND) U6.J6(GND) U6.J8(GND) U6.J9(VREFN_0) U6.J12(GND) U6.J16(GND) U6.K7(GND) U6.K10(VREFP_0) U6.K11(GND) U6.L2(GND) U6.L8(GND) U6.L12(GND) U6.L15(IO_L3P_T0_DQS_PUDC_B_14) U6.M5(GND) U6.M7(GND) U6.M9(GND) U6.M11(GND) U6.M15(GND) U6.N8(GND) U6.N10(GND) U6.N12(GND) U6.N18(GND) U6.P1(GND) U6.R4(GND) U6.R14(GND) U6.T7(GND) U6.T17(GND) U6.U10(GND) U6.V3(GND) U6.V13(GND) U8.11(GND) U8.21(GND) U8.26(GND) U9.4(GND) U10.1(VCC) U10.9(AVCC) U10.16(AVCC) U10.20(VCC) U10.33(VCC) U10.38(VCC) U10.49(VCC) U10.53(VCC) U10.66(VCC) U10.78(VCC) U10.85(VCC) U11.1(GND) U12.2(A1) U12.4(GND) U12.7(WP) U13.2(GND) XC1.2(GND) XC2.2(GND) XL1.2(GND)
VCC: C001.1 C26.1 C31.1 C41.1 D001.2(K) JP1.1 U1.2(VIN) U1.6(EN) U3.2(VIN) U3.6(EN) U5.1(VIN)
VCC0-AB: C49.1 C50.1 C77.1 C78.1 R26.2
VCC0-CD: C51.1 C52.1 C63.1 C64.1 R27.2
VCC_3V3: C13.1 C13A.1 C14.1 C14A.1 C15.1 C15A.1 C16.1 C16A.1 C17.1 C17A.1 C23.1 C230.1 IC7.15(EVDD) IC7.21(DEVDD) IC7.29(DEVDD) IC7.39(DEVDD) IC7.46(EVDD) IC7A.15(EVDD) IC7A.21(DEVDD) IC7A.29(DEVDD) IC7A.39(DEVDD) IC7A.46(EVDD) J1.1 J10.1 JP.2 W1.2(C2)
VCC_B_3.3V: C9.1 J1.2 J10.2 L2.1 L20.1 W2.2(C2)
VCC_TARGET: C1.2 C1A.2 C11.2 C110.2 D1A.2(ANODE) D2.2(ANODE) D2A.2(ANODE) IC2.4(VCC) IC2A.4(VCC) L2.2 L20.2 R1A.2 R101.2 R101A.2 R102.2 R102A.2
VIN: JP1.3
VUSB: CON2.1(VUSB) JP1.2
A-ID_SCL: IC2A.1(SCL) R102A.1 TP10A.1 U6.F16(IO_L14N_T2_SRCC_15)
A-ID_SDA: IC2A.3(SDA) R101A.1 TP11A.1 U6.H14(IO_L15P_T2_DQS_15)
A-IRQ: IC7A.40(IRQ) U6.G14(IO_L15N_T2_DQS_ADV_B_15)
A-LED_POWER: Q10.5(G1) R5A.1 TP12A.1 U6.K13(IO_L17P_T2_A26_15)
A-LED_TXRX: Q10.2(G2) R1A.1 TP13A.1 U6.D17(IO_L16N_T2_A27_15)
A-MISO: IC7A.44(MISO) U6.C15(IO_L12N_T1_MRCC_15)
A-MOSI: IC7A.43(MOSI) U6.H16(IO_L13P_T2_MRCC_15)
A-~{RSTN}: IC7A.13(~{RSTN}) U6.E17(IO_L16P_T2_A28_15)
A-~{SS_SEL}: IC7A.42(~{SELN}) U6.F15(IO_L14P_T2_SRCC_15)
A-SCLK: IC7A.41(SCLK) U6.G16(IO_L13N_T2_MRCC_15)
AD1-N: C94.2 R73.2 U6.B12(IO_L3N_T0_DQS_AD1N_15)
AD1-P: C94.1 R72.2 U6.C12(IO_L3P_T0_DQS_AD1P_15)
AD2-N: C96.2 R77.2 U6.B17(IO_L7N_T1_AD2N_15)
AD2-P: C96.1 R76.2 U6.B16(IO_L7P_T1_AD2P_15)
AD9-N: C95.2 R75.2 U6.F14(IO_L5N_T0_AD9N_15)
AD9-P: C95.1 R74.2 U6.F13(IO_L5P_T0_AD9P_15)
AD10-N: C97.2 R79.2 U6.A16(IO_L8N_T1_AD10N_15)
AD10-P: C97.1 R78.2 U6.A15(IO_L8P_T1_AD10P_15)
AD12-N: C91.2 R67.2 U6.B6(IO_L2N_T0_AD12N_35)
AD12-P: C91.1 R66.2 U6.B7(IO_L2P_T0_AD12P_35)
AD13-N: C92.2 R69.2 U6.E5(IO_L5N_T0_AD13N_35)
AD13-P: C92.1 R68.2 U6.E6(IO_L5P_T0_AD13P_35)
AD14-N: C93.2 R71.2 U6.A3(IO_L8N_T1_AD14N_35)
AD14-P: C93.1 R70.2 U6.A4(IO_L8P_T1_AD14P_35)
AT_CLK0: C24.1 R12.1 U6.P5(IO_L13N_T2_MRCC_34) ; port AT_CLK0, port AT-CLK0
AT_CLK1: C24A.1 R12A.1 U6.P3(IO_L14N_T2_SRCC_34) ; port AT_CLK1, port AT-CLK1
B1_N: B1.3(Balanced_P1) B1A.3(Balanced_P1) C12.2 C12A.2 L3.1 L3A.1
B1_P: B1.4(Balanced_P2) B1A.4(Balanced_P2) C2.2 C02A.2 L3.2 L3A.2
CK-A0: P-ADC.1 R65.2
CK-A1: P-ADC.3 R64.2
CK-A2: P-ADC.5 R63.2
CK-A3: P-ADC.7 R62.2
CK-A4: P-ADC.9 R61.2
CK-A5: P-ADC.11 R60.2
CK-A6: P-ADC.2 R66.1
CK-A7: P-ADC.4 R67.1
CK-A8: P-ADC.6 R68.1
CK-A9: P-ADC.8 R69.1
CK-A10: P-ADC.10 R70.1
CK-A11: P-ADC.12 R71.1
CK-AN0-N: C85.2 R46.1 U6.C5(IO_L1N_T0_AD4N_35)
CK-AN0-P: C85.1 R40.1 U6.C6(IO_L1P_T0_AD4P_35)
CK-AN1-N: C86.2 R47.1 U6.A5(IO_L3N_T0_DQS_AD5N_35)
CK-AN1-P: C86.1 R41.1 U6.A6(IO_L3P_T0_DQS_AD5P_35)
CK-AN2-N: C87.2 R48.1 U6.B4(IO_L7N_T1_AD6N_35)
CK-AN2-P: C87.1 R42.1 U6.C4(IO_L7P_T1_AD6P_35)
CK-AN3-N: C88.2 R49.1 U6.A1(IO_L9N_T1_DQS_AD7N_35)
CK-AN3-P: C88.1 R43.1 U6.B1(IO_L9P_T1_DQS_AD7P_35)
CK-AN4-N: C89.2 R50.1 U6.B2(IO_L10N_T1_AD15N_35)
CK-AN4-P: C89.1 R44.1 U6.B3(IO_L10P_T1_AD15P_35)
CK-AN5-N: C90.2 R51.1 U6.C14(IO_L1N_T0_AD0N_15)
CK-AN5-P: C90.1 R45.1 U6.D14(IO_L1P_T0_AD0P_15)
CLK1: C25A.1 IC8.2(CLK1) ; port CLK1
CTL0: U6.N16(IO_L11N_T1_SRCC_14) U10.54(CTL0/FLAGA)
CTL1: U6.N15(IO_L11P_T1_SRCC_14) U10.55(CTL1/FLAGB)
CTL2: U6.N14(IO_L8P_T1_D11_14) U10.56(CTL2/FLAGC)
CTL3: U6.N17(IO_L9P_T1_DQS_14) U10.51(CTL3)
CTL4: U6.M13(IO_L6N_T0_D08_VREF_14) U10.52(CTL4)
CTL5: U10.76(CTL5)
CTLS: U8.2(I/O(1)) ; port CTLS
FXCLK: R018.2 U6.P15(IO_L13P_T2_MRCC_14) ; port FXCLK
ID_SCL: IC2.1(SCL) R102.1 TP10.1 U6.C17(IO_L20N_T3_A19_15)
ID_SDA: IC2.3(SDA) R101.1 TP11.1 U6.E18(IO_L21P_T3_DQS_15)
IFCLK: R019.2 U6.P17(IO_L12P_T1_MRCC_14) ; port IFCLK
INT4: U6.D10(IO_L19N_T3_VREF_16) U10.22(INT4) ; port INT4
INT5#: U6.U12(IO_L20P_T3_A08_D24_14) U10.84(~{INT5}) ; port INT5#
IRQ: IC7.40(IRQ) U6.D18(IO_L21N_T3_DQS_A18_15)
LED_POWER: Q1.5(G1) R5.1 TP12.1 U6.J17(IO_L23P_T3_FOE_B_15)
LED_TXRX: Q1.2(G2) R1.1 TP13.1 U6.F18(IO_L22N_T3_A16_15)
M0: U6.P12(M0_0) U8.19(I/O) ; port M0
M1: U6.P13(M1_0) U8.23(I/O) ; port M1
M2: U6.P11(M2_0) U8.24(I/O) ; port M2
MISO: IC7.44(MISO) U6.G17(IO_L18N_T2_A23_15)
MOSI: IC7.43(MOSI) U6.H17(IO_L18P_T2_A24_15)
MR#: U11.3(~{MR}) ; port MR#
PA0: U6.R15(IO_L13N_T2_MRCC_14) U10.67(PA0/~{INT0})
PA1: U6.T15(IO_L14N_T2_SRCC_14) U10.68(PA1/~{IN}T~{1})
PA2: U6.T14(IO_L14P_T2_SRCC_14) U10.69(PA2/SLOE)
PA3: U6.T13(IO_L23P_T3_A03_D19_14) U10.70(PA3/WU2)
PA4: U6.R11(IO_0_14) U10.71(PA4/FIFOADR0)
PA5: U6.T11(IO_L19P_T3_A10_D26_14) U10.72(PA5/FIFOADR1)
PA6: U6.R10(IO_25_14) U10.73(PA6/PKTEND)
PA7: U6.T10(IO_L24N_T3_A00_D16_14) U10.74(PA7/FLAGD/~{SLCS})
PB0: U6.M16(IO_L10P_T1_D14_14) U8.9(I/O) U10.34(PB0/FD[0])
PB1: U6.L16(IO_L3N_T0_DQS_EMCCLK_14) U8.8(I/O) U10.35(PB1/FD[1])
PB2: U6.L14(IO_L2P_T0_D02_14) U10.36(PB2/FD[2])
PB3: U6.M14(IO_L2N_T0_D03_14) U10.37(PB3/FD[3])
PB4: U6.L18(IO_L4P_T0_D04_14) U10.44(PB4/FD[4])
PB5: U6.M18(IO_L4N_T0_D05_14) U10.45(PB5/FD[5])
PB6: U6.R12(IO_L5P_T0_D06_14) U10.46(PB6/FD[6])
PB7: U6.R13(IO_L5N_T0_D07_14) U10.47(PB7/FD[7])
PC0: U6.R17(IO_L12N_T1_MRCC_14) U10.57(PC0/GPIFADR0)
PC1: U6.R18(IO_L7P_T1_D09_14) U10.58(PC1/GPIFADR1)
PC2: U6.P18(IO_L9N_T1_DQS_D13_14) U10.59(PC2/GPIFADR2)
PC3: U6.P14(IO_L8N_T1_D12_14) U10.60(PC3/GPIFADR3)
PC4: U6.K18(IO_L1N_T0_D01_DIN_14) U8.7(I/O) U9.2(DOUT/IO1) U10.61(PC4/GPIFADR4)
PC5: U6.L13(IO_L6P_T0_FCS_B_14) U8.17(I/O) U9.1(~{CS}) U10.62(PC5/GPIFADR5)
PC6: U6.E9(CCLK_0) U8.6(I/O) U9.6(CLK) U10.63(PC6/GPIFADR6) ; port PC6
PC7: U6.K17(IO_L1P_T0_D00_MOSI_14) U8.5(I/O) U9.5(DIN/IO0) U10.64(PC7/GPIFADR7)
PD0: U6.T9(IO_L24P_T3_A01_D17_14) U10.80(PD0/FD[8])
PD1: U6.V10(IO_L21P_T3_DQS_14) U10.81(PD1/FD[9])
PD2: U6.U11(IO_L19N_T3_A09_D25_VREF_14) U10.82(PD2/FD[10])
PD3: U6.V11(IO_L21N_T3_DQS_A06_D22_14) U10.83(PD3/FD[11])
PD4: U6.V12(IO_L20N_T3_A07_D23_14) U10.95(PD4/FD[12])
PD5: U6.U13(IO_L23N_T3_A02_D18_14) U10.96(PD5/FD[13])
PD6: U6.U14(IO_L22P_T3_A05_D21_14) U10.97(PD6/FD[14])
PD7: U6.V14(IO_L22N_T3_A04_D20_14) U10.98(PD7/FD[15])
PE0: R15B.2 U6.P10(DONE_0) U10.86(PE0/T0OUT) ; port PE0
PE1: U6.P7(INIT_B_0) U10.87(PE1/T1OUT) ; port PE1
PE2: U6.V15(IO_L16P_T2_CSI_B_14) U10.88(PE2/T2OUT)
PE3: U8.32(I/O) U10.89(PE3/RXD0OUT)
PE4: U8.31(I/O) U10.90(PE4/RXD1OUT)
PE5: U6.R16(IO_L15P_T2_DQS_RDWR_B_14) U10.91(PE5/INT6)
PE6: U6.T16(IO_L15N_T2_DQS_DOUT_CSO_B_14) U10.92(PE6/T2EX)
PE7: U8.29(I/O) U10.93(PE7/GPIFADR8)
PROG_B: U6.P9(PROGRAM_B_0) U8.18(TDI) ; port PROG_B
~{RESET}: U8.1(I/O(1)) U10.77(~{RESET}) U11.2(~{RESET}) ; port ~{RESET}
~{RSTN}: IC7.13(~{RSTN}) U6.G18(IO_L22P_T3_A17_15)
RDX0: U6.A11(IO_L4N_T0_15) U10.41(RXD0) ; port RDX0
RDY0: U6.V16(IO_L16N_T2_A15_D31_14) U10.3(RDY0/SLRD)
RDY1: U6.U16(IO_L18P_T2_A12_D28_14) U10.4(RDY1/SLWR)
RDY2: U6.U17(IO_L17P_T2_A14_D30_14) U10.5(RDY2)
RDY3: U6.V17(IO_L18N_T2_A11_D27_14) U10.6(RDY3)
RDY4: U6.U18(IO_L17N_T2_A13_D29_14) U10.7(RDY4)
RDY5: U6.T18(IO_L7N_T1_D10_14) U10.8(RDY5) ; port RDY5
RF09_N: IC7.9(RFN09) L1.4
RF09_P: IC7.8(RFP09) L1.1(I)
RF09A_N: IC7A.9(RFN09) L1A.4
RF09A_P: IC7A.8(RFP09) L1A.1(I)
RF24_N: C12.1 IC7.5(RFN24)
RF24_P: C2.1 IC7.4(RFP24)
RF24A_N: C12A.1 IC7A.5(RFN24)
RF24A_P: C02A.1 IC7A.4(RFP24)
RXCLKA_N: IC7A.33(RXCLKN) U6.M2(IO_L4N_T0_34)
RXCLKA_P: IC7A.34(RXCLKP) U6.M3(IO_L4P_T0_34)
RXCLKN: IC7.33(RXCLKN) U6.V4(IO_L10N_T1_34)
RXCLKP: IC7.34(RXCLKP) U6.V5(IO_L10P_T1_34)
RXD0: U6.A8(IO_L12N_T1_MRCC_16) ; port RXD0
RXD24A_N: IC7A.35(RXDN24) U6.L4(IO_L5N_T0_34)
RXD24A_P: IC7A.36(RXDP24) U6.K5(IO_L5P_T0_34)
RXD24N: IC7.35(RXDN24) U6.T3(IO_L11N_T1_SRCC_34)
RXD24P: IC7.36(RXDP24) U6.R3(IO_L11P_T1_SRCC_34)
RXDN09: IC7.30(RXDN09) U6.V2(IO_L9N_T1_DQS_34)
RXDN09A_N: IC7A.30(RXDN09) U6.N1(IO_L3N_T0_DQS_34)
RXDP09: IC7.31(RXDP09) U6.U2(IO_L9P_T1_DQS_34)
RXDP09A_P: IC7A.31(RXDP09) U6.N2(IO_L3P_T0_DQS_34)
~{SS_SEL}: IC7.42(~{SELN}) U6.C16(IO_L20P_T3_A20_15)
SCL: R001.1 U6.B8(IO_L12P_T1_MRCC_16) U10.29(SCL) U12.6(SCL) U13.1(SCL) ; port SCL
SCLK: IC7.41(SCLK) U6.J14(IO_L19P_T3_A22_15)
SDA: R002.1 U6.A10(IO_L14P_T2_SRCC_16) U10.30(SDA) U12.5(SDA) U13.3(SDA) ; port SDA
SNS0V95-N: P-ADC.20 R79.1
SNS0V95-P: P-ADC.19 R78.1
SNS5V0-N: P-ADC.16 R75.1
SNS5V0-P: P-ADC.15 R74.1
T0: U6.M17(IO_L10N_T1_D15_14) U10.23(T0) ; port T0
TCK: DA.2(K) R147.1 U6.E10(TCK_0) U8.16(TCK) ; port TCK
TDI: DC.2(K) R145.1 U6.E11(TDI_0) U8.14(TDI) ; port TDI
TDO: DB.2(K) R146.1 U6.E13(TDO_0) U8.25(TDO) ; port TDO
TDX0: U6.B11(IO_L4P_T0_15) U10.40(TXD0) ; port TDX0
TMS: DD.2(K) R144.1 U6.E12(TMS_0) U8.15(TMS) ; port TMS
TXCLKA_N: IC7A.25(TXCLKN) U6.M1(IO_L1N_T0_34)
TXCLKA_P: IC7A.26(TXCLKP) U6.L1(IO_L1P_T0_34)
TXCLKN: IC7.25(TXCLKN) U6.V1(IO_L7N_T1_34)
TXCLKP: IC7.26(TXCLKP) U6.U1(IO_L7P_T1_34)
TXD0: U6.A9(IO_L14N_T2_SRCC_16) ; port TXD0
TXDA_N: IC7A.27(TXDN) U6.L3(IO_L2N_T0_34)
TXDA_P: IC7A.28(TXDP) U6.K3(IO_L2P_T0_34)
TXDN: IC7.27(TXDN) U6.U3(IO_L8N_T1_34)
TXDP: IC7.28(TXDP) U6.U4(IO_L8P_T1_34)
VSNS5V0-N: P-ADC.14 R73.1
VSNS5V0-P: P-ADC.13 R72.1
VSNSVU-N: P-ADC.18 R77.1
VSNSVU-P: P-ADC.17 R76.1
NetB1_1: B1.1(unbalanced) C3.1
NetB1A_1: B1A.1(unbalanced) C3A.1
NetC01_1: C01.1 U10.11(XTALIN) XL1.1(OS1)
NetC002_1: C002.1 U10.10(XTALOUT) XL1.3(OS2)
NetC3_2: C3.2 C21.1 R4.1
NetC3A_2: C3A.2 C21A.1 R4A.1
NetC4_1: C4.1 R4.2 R10.2 SMA2.1
NetC4A_1: C4A.1 R4A.2 R10A.2 SMA3.1
NetC5_1: C5.1 L1.3
NetC5A_1: C5A.1 L1A.3
NetC7_1: C7.1 R9.2 R11.2 SMA1.1
NetC7A_1: C7A.1 R9A.2 R11A.2 SMA4.1
NetC8_1: C8.1 L1.2
NetC8_2: C8.2 C22.1 R9.1
NetC08A_1: C08A.1 L1A.2
NetC08A_2: C08A.2 C22A.1 R9A.1
NetC10_1: C10.1 C25.2 IC7.17(TCXO) R13.2
NetC10A_1: C10A.1 C25A.2 IC7A.17(TCXO) R13A.2
NetC024A_1: C024A.1 IC8.1(FIN) P1A.1(SIG) TP8.1 XC1.3(OUTPUT)
NetC25_1: C25.1 IC8.4(CLK0)
NetC27_1: C27.1 R14.1
NetC28_1: C28.1 U1.7(SS)
NetC32_1: C32.1 R17.1
NetC33_1: C33.1 U3.7(SS)
NetC41_2: C41.2 U5.8(GND)
NetC42_1: C42.1 U5.4(BOOT)
NetC42_2: C42.2 L7.1 U5.2(SW) U5.3(SW)
NetC46_1: C46.1 U5.7(VCC)
NetC47_1: C47.1 U06.1(VIN) U06.3(EN)
NetCON2_2: CON2.2(DM) U10.18(DMINUS)
NetCON2_3: CON2.3(DP) U10.17(DPLUS)
NetD1_1: D1.1(CATHODE) R2.2
NetD1_2: D1.2(ANODE) R1.2
NetD1A_1: D1A.1(CATHODE) R2A.2
NetD2_1: D2.1(CATHODE) R3.2
NetD2A1_2: D2A1.2(K) R15B.1
NetD2A_1: D2A.1(CATHODE) R3A.2
NetIC7_1: IC7.1(FEA24) J104.1
NetIC7_2: IC7.2(FEB24) J104.2
NetIC7_11: IC7.11(FEA09) J105.1
NetIC7_12: IC7.12(FEB09) J105.2
NetIC7_18: IC7.18(XTAL2) R7.1
NetIC7_22: IC7.22(CLKO) R12.2
NetIC7A_1: IC7A.1(FEA24) J104A.1
NetIC7A_2: IC7A.2(FEB24) J104A.2
NetIC7A_11: IC7A.11(FEA09) J105A.1
NetIC7A_12: IC7A.12(FEB09) J105A.2
NetIC7A_18: IC7A.18(XTAL2) R7A.1
NetIC7A_22: IC7A.22(CLKO) R12A.2
NetIC8_5: IC8.5(VDD) W1.1(C1)
NetL4_1: L4.1 U1.9(LX(PAD))
NetL5_1: L5.1 U3.9(LX(PAD))
NetL8_1: L8.1 U06.5(LX(PAD))
NetP1_1: P1.1(TMS) R144.2
NetP1_2: P1.2(TDI) R145.2
NetP1_3: P1.3(TDO) R146.2
NetP1_4: P1.4(TCK) R147.2
NetP4_1: P4.1 R032.1 U12.3(A2)
NetPio_1: Pio.1 U6.D8(IO_L4P_T0_35)
NetPio_2: Pio.2 U6.C7(IO_L4N_T0_35)
NetPio_3: Pio.3 U6.C2(IO_L16P_T2_35)
NetPio_4: Pio.4 U6.H1(IO_L17P_T2_35)
NetPio_5: Pio.5 U6.G1(IO_L17N_T2_35)
NetPio_6: Pio.6 U6.F1(IO_L18P_T2_35)
NetPio_7: Pio.7 U6.E1(IO_L18N_T2_35)
NetPio_8: Pio.8 U6.J3(IO_L22P_T3_35)
NetPio_9: Pio.9 U6.J2(IO_L22N_T3_35)
NetPio_10: Pio.10 U6.D7(IO_L6N_T0_VREF_35)
NetPio_11: Pio.11 U6.D4(IO_L11N_T1_SRCC_35)
NetPio_12: Pio.12 U6.F4(IO_L13P_T2_MRCC_35)
NetPio_13: Pio.13 U6.F3(IO_L13N_T2_MRCC_35)
NetPio_14: Pio.14 U6.E2(IO_L14P_T2_SRCC_35)
NetPio_15: Pio.15 U6.H2(IO_L15P_T2_DQS_35)
NetPio_16: Pio.16 U6.G2(IO_L15N_T2_DQS_35)
NetPio_17: Pio.17 U6.C1(IO_L16N_T2_35)
NetPio_18: Pio.18 U6.G6(IO_L19P_T3_35)
NetPio_19: Pio.19 U6.F6(IO_L19N_T3_VREF_35)
NetPio_20: Pio.20 U6.G4(IO_L20P_T3_35)
NetQ1_3: Q1.3(D1) R3.1
NetQ1_6: Q1.6(D2) R2.1
NetQ10_3: Q10.3(D1) R3A.1
NetQ10_6: Q10.6(D2) R2A.1
NetR14_2: R14.2 U1.5(COMP)
NetR015_1: R015.1 R16.2 U1.4(FB)
NetR17_2: R17.2 U3.5(COMP)
NetR018_1: R018.1 U10.100(CLKOUT)
NetR18_1: R18.1 R19.2 U3.4(FB)
NetR019_1: R019.1 U10.26(IFCLK)
NetR23_1: R23.1 R24.2 R25.1
NetR23_2: R23.2 U5.6(FB)
NetR40_2: R40.2 R58.2 R65.1
NetR41_2: R41.2 R57.2 R64.1
NetR42_2: R42.2 R56.2 R63.1
NetR43_2: R43.2 R55.2 R62.1
NetR44_2: R44.2 R54.2 R61.1
NetR45_2: R45.2 R53.2 R60.1
NetU6_E3: U6.E3(IO_L12P_T1_MRCC_35) XC2.3(OUTPUT)
NetU8_10: U8.10(I/O) U9.7(~{HOLD}/RESET)
NetU8_13: U8.13(I/O) U9.3(~{WP}/IO2)
NetW2_1: W2.1(C1) XC1.4(VCC)

Not connected (* = marked no-connect by the designer): B1 6(nc)*; B1A 6(nc)*; CON2 4(NC)*; IC8 6(OE); U1 8(NC); U3 8(NC); U6 A13(IO_L9P_T1_DQS_AD3P_15) A14(IO_L9N_T1_DQS_AD3N_15) A18(IO_L10N_T1_AD11N_15) B9(IO_L11N_T1_SRCC_16) B13(IO_L2P_T0_AD8P_15) B14(IO_L2N_T0_AD8N_15) B18(IO_L10P_T1_AD11P_15) C9(IO_L11P_T1_SRCC_16) C10(IO_L13N_T2_MRCC_16) C11(IO_L13P_T2_MRCC_16) D2(IO_L14N_T2_SRCC_35) D3(IO_L12N_T1_MRCC_35) D5(IO_L11P_T1_SRCC_35) D9(IO_L6N_T0_VREF_16) D12(IO_L6P_T0_15) D13(IO_L6N_T0_VREF_15) D15(IO_L12P_T1_MRCC_15) E7(IO_L6P_T0_35) E8(VCCBATT_0)* E15(IO_L11P_T1_SRCC_15) E16(IO_L11N_T1_SRCC_15) F5(IO_0_35)* G3(IO_L20N_T3_35) G13(IO_0_15) H4(IO_L21N_T3_DQS_35) H5(IO_L24N_T3_35) H6(IO_L24P_T3_35) H9(GNDADC_0) H10(VCCADC_0) H15(IO_L19N_T3_A21_VREF_15) J4(IO_L21P_T3_DQS_35) J5(IO_25_35) J10(VP_0)* J13(IO_L17N_T2_A25_15) J15(IO_L24N_T3_RS0_15) J18(IO_L23N_T3_FWE_B_15) K1(IO_L23N_T3_35) K2(IO_L23P_T3_35) K6(IO_0_34) K9(VN_0)* K15(IO_L24P_T3_RS1_15) K16(IO_25_15) L5(IO_L6N_T0_VREF_34) L6(IO_L6P_T0_34)* L9(DXN_0)* L10(DXP_0)* M4(IO_L16P_T2_34)* M6(IO_L18P_T2_34)* N4(IO_L16N_T2_34)* N5(IO_L13P_T2_MRCC_34)* N6(IO_L18N_T2_34)* P2(IO_L15P_T2_DQS_34)* P4(IO_L14P_T2_SRCC_34)* R1(IO_L17P_T2_34)* R2(IO_L15N_T2_DQS_34)* R5(IO_L19N_T3_VREF_34) R6(IO_L19P_T3_34)* R7(IO_L23P_T3_34)* R8(IO_L24P_T3_34)* T1(IO_L17N_T2_34)* T4(IO_L12N_T1_MRCC_34)* T5(IO_L12P_T1_MRCC_34) T6(IO_L23N_T3_34)* T8(IO_L24N_T3_34)* U6(IO_L22N_T3_34)* U7(IO_L22P_T3_34)* U8(IO_25_34) U9(IO_L21P_T3_DQS_34)* V6(IO_L20N_T3_34)* V7(IO_L20P_T3_34)* V9(IO_L21N_T3_DQS_34)*; U8 3(I/O(1))* 22(INPUT)* 28(I/O)* 30(I/O)*; U10 13(NC)* 14(NC)* 15(NC)* 24(T1)* 25(T2)* 27(Reserved) 28(BKPT)* 31(~{RD}) 32(~{WR}) 42(TXD1)* 43(RXD1)* 79(WAKEUP)*; XC1 1(NC); XC2 1(NC)*; XL1 4(GND(NC))

## Layout directives
differential pair: B1_N, B1_P, RF09_N, RF09_P, RF09A_N, RF09A_P, RF24_N, RF24_P, RF24A_N, RF24A_P
mark named 50 ohm PCB Track: NetC3_2, NetC3A_2, NetC4_1, NetC4A_1, NetC7_1, NetC7A_1, NetC8_2, NetC08A_2

## Notes on the sheet
- Power and RF Status LEDs
- PA[0-7]
- PC[0-7]
- (near J104) FRONT END AMPLIER
- PB[0-7]
- RF Filter
- CTL[0-4]
- PE[2-5]
- (near R10) ESD Protection
- RDY[0-4]
- Use Balun part DLW21SN900SQ2 for
  sub-1 GHz bands (389.5 - 510MHz, 779 - 1020MHz)
- PD[0-7]
- (near R11) ESD Protection
- Current Measurement
- Decoupling capacitors
- PC[4,6,7]
- PB[0-1]
- PC[4-7]
- M[0-2]
- PC[3,4,7]
- (near R10A) ESD Protection
- (near R11A) ESD Protection
- 1.8 VOLT DC MODULE
- (near U06) Page        of
- (near U06) 9
- (near R001) PB[0-7]
- POWER JACK
- RDY[0-5]
- CTL[0-5]
- (near U10) USB Microcontroller
- PE[0-7]
- Labels drawn without touching a wire or pin: GND, SNS0V95-P, VCC_TARGET
- (in symbol AT86RF215) QFN48; Dual band (GHz/2.4GHz )transceiver
- (in symbol CY7C68014A-100AXC) 100-Pin TQFP
- (in symbol D Schottky) 16V
- (in symbol SC189SKTRT) SC189
- (in symbol UP SUPERVISORY) SOT143-4
- (in symbol XC7A35T-2CSG324I, part A) BANK 14
- (in symbol XC7A35T-2CSG324I, part B) BANK 15
- (in symbol XC7A35T-2CSG324I, part C) BANK 16
- (in symbol XC7A35T-2CSG324I, part D) BANK 34
- (in symbol XC7A35T-2CSG324I, part E) BANK 35
- (in symbol XC7A35T-2CSG324I, part J) ADC